# Altium project eBox_main.PrjPcb (part 1 of 2)
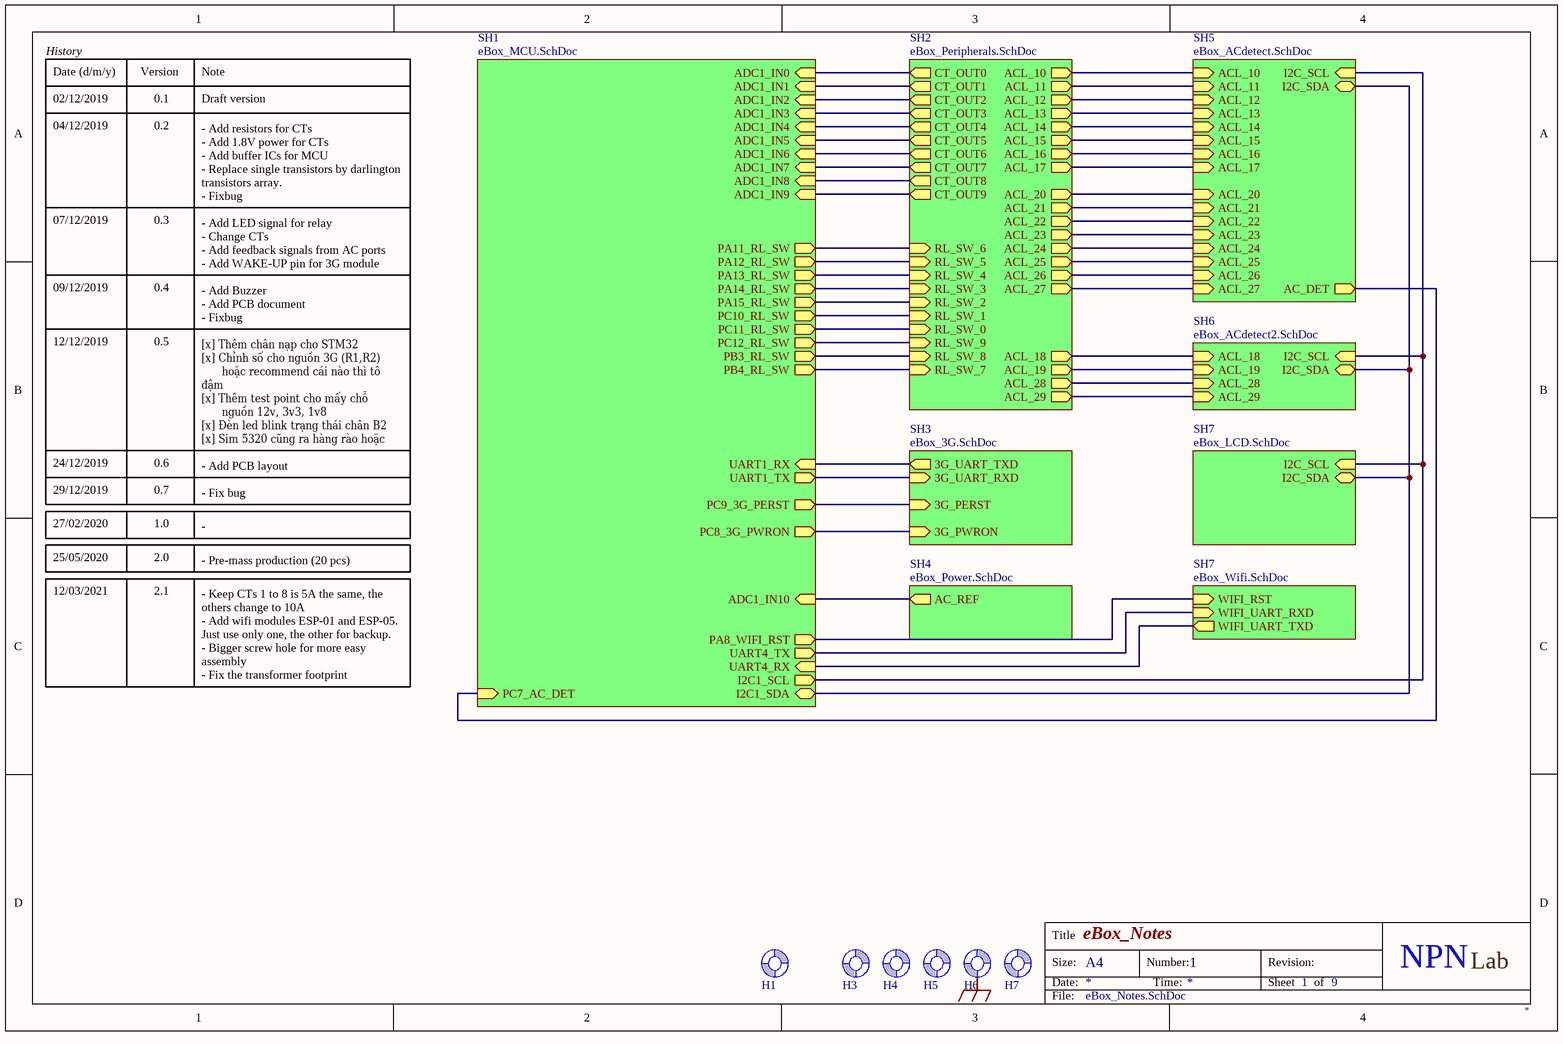
[diagram p0: eBox_Notes.SchDoc]
Hash: FK9KUBJZ; Version: 3.0
9 sheets, 424 parts. Net scope: hierarchical (ports join the sheet entries above them; power ports are global).
Board file: eBox_main.PcbDoc
Sheets:
  eBox_Notes.SchDoc
    SH1 = eBox_MCU.SchDoc
    SH2 = eBox_Peripherals.SchDoc
    SH3 = eBox_3G.SchDoc
    SH4 = eBox_Power.SchDoc
    SH5 = eBox_ACdetect.SchDoc
    SH6 = eBox_ACdetect2.SchDoc
    SH7 = eBox_LCD.SchDoc
    SH7 = eBox_Wifi.SchDoc

## Sheet eBox_Notes.SchDoc: eBox_Notes
size A4; DocumentNumber: 1; SheetNumber: 1; SheetTotal: 9

### Parts
H1  Screw Hole  [SCREW/3.2/7.0/M]  (value not drawn)  (no BOM)
H3  Screw Hole  [SCREW/3.2/7.0/M]  (value not drawn)  (no BOM)
H4  Screw Hole  [SCREW/3.2/7.0/M]  (value not drawn)  (no BOM)
H5  Screw Hole  [SCREW/3.2/7.0/M]  (value not drawn)  (no BOM)
H6  Screw Hole  [SCREW/3.2/7.0/M]  (value not drawn)  (no BOM)
H7  Screw Hole  [SCREW/3.2/7.0/M]  (value not drawn)  (no BOM)

### Sub-sheets
SH1 = eBox_MCU.SchDoc: PC8_3G_PWRON (out), PC9_3G_PERST (out), UART1_RX (in), UART1_TX (out), ADC1_IN0 (in), ADC1_IN1 (in), ADC1_IN2 (in), ADC1_IN3 (in), ADC1_IN4 (in), ADC1_IN5 (in), ADC1_IN6 (in), ADC1_IN9 (in), ADC1_IN7 (in), PA12_RL_SW (out), ADC1_IN8 (in), PA11_RL_SW (out), PA13_RL_SW (out), PA14_RL_SW (out), PA15_RL_SW (out), PC10_RL_SW (out), PC11_RL_SW (out), PB3_RL_SW (out), PB4_RL_SW (out), PC12_RL_SW (out), I2C1_SCL (out), I2C1_SDA (bidir), PC7_AC_DET (in), ADC1_IN10 (in), UART4_RX (in), UART4_TX (out), PA8_WIFI_RST (out)
SH2 = eBox_Peripherals.SchDoc: CT_OUT0 (out), CT_OUT1 (out), CT_OUT2 (out), CT_OUT3 (out), CT_OUT4 (out), CT_OUT5 (out), CT_OUT6 (out), CT_OUT7 (out), CT_OUT8 (out), CT_OUT9 (out), RL_SW_6 (in), RL_SW_5 (in), RL_SW_4 (in), RL_SW_3 (in), RL_SW_2 (in), RL_SW_1 (in), RL_SW_0 (in), RL_SW_9 (in), RL_SW_8 (in), RL_SW_7 (in), ACL_25 (out), ACL_24 (out), ACL_21 (out), ACL_20 (out), ACL_15 (out), ACL_14 (out), ACL_13 (out), ACL_10 (out), ACL_12 (out), ACL_11 (out), ACL_17 (out), ACL_16 (out), ACL_19 (out), ACL_18 (out), ACL_23 (out), ACL_28 (out), ACL_26 (out), ACL_22 (out), ACL_27 (out), ACL_29 (out)
SH3 = eBox_3G.SchDoc: 3G_UART_RXD (in), 3G_PERST (in), 3G_PWRON (in), 3G_UART_TXD (out)
SH4 = eBox_Power.SchDoc: AC_REF (out)
SH5 = eBox_ACdetect.SchDoc: I2C_SDA (bidir), I2C_SCL (in), ACL_16 (in), ACL_14 (in), ACL_15 (in), ACL_13 (in), ACL_11 (in), ACL_10 (in), ACL_12 (in), ACL_25 (in), ACL_24 (in), ACL_27 (in), ACL_26 (in), ACL_23 (in), ACL_22 (in), ACL_21 (in), ACL_20 (in), ACL_17 (in), AC_DET (out)
SH6 = eBox_ACdetect2.SchDoc: I2C_SDA (bidir), I2C_SCL (in), ACL_19 (in), ACL_29 (in), ACL_18 (in), ACL_28 (in)
SH7 = eBox_LCD.SchDoc: I2C_SCL (in), I2C_SDA (bidir)
SH7 = eBox_Wifi.SchDoc: WIFI_UART_TXD (out), WIFI_UART_RXD (in), WIFI_RST (in)

### Nets
GNDEARTH: H6.1(Screw)
ACL10: sheet SH2/ACL_10, sheet SH5/ACL_10
ACL11: sheet SH2/ACL_11, sheet SH5/ACL_11
ACL12: sheet SH2/ACL_12, sheet SH5/ACL_12
ACL13: sheet SH2/ACL_13, sheet SH5/ACL_13
ACL14: sheet SH2/ACL_14, sheet SH5/ACL_14
ACL15: sheet SH2/ACL_15, sheet SH5/ACL_15
ACL16: sheet SH2/ACL_16, sheet SH5/ACL_16
ACL17: sheet SH2/ACL_17, sheet SH5/ACL_17
ACL18: sheet SH2/ACL_18, sheet SH6/ACL_18
ACL19: sheet SH2/ACL_19, sheet SH6/ACL_19
ACL20: sheet SH2/ACL_20, sheet SH5/ACL_20
ACL21: sheet SH2/ACL_21, sheet SH5/ACL_21
ACL22: sheet SH2/ACL_22, sheet SH5/ACL_22
ACL23: sheet SH2/ACL_23, sheet SH5/ACL_23
ACL24: sheet SH2/ACL_24, sheet SH5/ACL_24
ACL25: sheet SH2/ACL_25, sheet SH5/ACL_25
ACL26: sheet SH2/ACL_26, sheet SH5/ACL_26
ACL27: sheet SH2/ACL_27, sheet SH5/ACL_27
ACL28: sheet SH2/ACL_28, sheet SH6/ACL_28
ACL29: sheet SH2/ACL_29, sheet SH6/ACL_29
I2C1_SCL: sheet SH1/I2C1_SCL, sheet SH5/I2C_SCL, sheet SH6/I2C_SCL, sheet SH7/I2C_SCL
I2C1_SDA: sheet SH1/I2C1_SDA, sheet SH5/I2C_SDA, sheet SH6/I2C_SDA, sheet SH7/I2C_SDA
PERST: sheet SH1/PC9_3G_PERST, sheet SH3/3G_PERST
PWRON: sheet SH1/PC8_3G_PWRON, sheet SH3/3G_PWRON
UART4_RX: sheet SH1/UART4_RX, sheet SH7/WIFI_UART_TXD
UART4_TX: sheet SH1/UART4_TX, sheet SH7/WIFI_UART_RXD
UART_RXD: sheet SH1/UART1_RX, sheet SH3/3G_UART_TXD
UART_TXD: sheet SH1/UART1_TX, sheet SH3/3G_UART_RXD
NetC538_2: sheet SH1/PC7_AC_DET, sheet SH5/AC_DET
NetM801_4: sheet SH1/PA8_WIFI_RST, sheet SH7/WIFI_RST
NetR103_1: sheet SH1/ADC1_IN10, sheet SH4/AC_REF
NetU201_14: sheet SH1/ADC1_IN0, sheet SH2/CT_OUT0
NetU201_15: sheet SH1/ADC1_IN1, sheet SH2/CT_OUT1
NetU201_16: sheet SH1/ADC1_IN2, sheet SH2/CT_OUT2
NetU201_17: sheet SH1/ADC1_IN3, sheet SH2/CT_OUT3
NetU201_20: sheet SH1/ADC1_IN4, sheet SH2/CT_OUT4
NetU201_21: sheet SH1/ADC1_IN5, sheet SH2/CT_OUT5
NetU201_22: sheet SH1/ADC1_IN6, sheet SH2/CT_OUT6
NetU201_23: sheet SH1/ADC1_IN7, sheet SH2/CT_OUT7
NetU201_26: sheet SH1/ADC1_IN8, sheet SH2/CT_OUT8
NetU201_27: sheet SH1/ADC1_IN9, sheet SH2/CT_OUT9
NetU202_12: sheet SH1/PC11_RL_SW, sheet SH2/RL_SW_0
NetU202_13: sheet SH1/PC10_RL_SW, sheet SH2/RL_SW_1
NetU202_14: sheet SH1/PA15_RL_SW, sheet SH2/RL_SW_2
NetU202_15: sheet SH1/PA14_RL_SW, sheet SH2/RL_SW_3
NetU202_16: sheet SH1/PA13_RL_SW, sheet SH2/RL_SW_4
NetU202_17: sheet SH1/PA12_RL_SW, sheet SH2/RL_SW_5
NetU202_18: sheet SH1/PA11_RL_SW, sheet SH2/RL_SW_6
NetU204_16: sheet SH1/PB4_RL_SW, sheet SH2/RL_SW_7
NetU204_17: sheet SH1/PB3_RL_SW, sheet SH2/RL_SW_8
NetU204_18: sheet SH1/PC12_RL_SW, sheet SH2/RL_SW_9

Not connected (* = marked no-connect by the designer): H1 1(Screw); H3 1(Screw); H4 1(Screw); H5 1(Screw); H7 1(Screw)

### Notes on the sheet
- History
- Date (d/m/y)
- 02/12/2019
- Version
- 0.1
- Note
- Draft version
- 04/12/2019
- 0.2
- 07/12/2019
- 0.3
- - Add resistors for CTs
  - Add 1.8V power for CTs
  - Add buffer ICs for MCU
  - Replace single transistors by darlington  transistors array.
  - Fixbug
- 09/12/2019
- 0.4
- - Add LED signal for relay
  - Change CTs
  - Add feedback signals from AC ports
  - Add WAKE-UP pin for 3G module
- 12/12/2019
- 0.5
- - Add Buzzer
  - Add PCB document
  - Fixbug
- [x] Thêm chân nạp cho STM32
  [x] Chỉnh số cho nguồn 3G (R1,R2)
  hoặc recommend cái nào thì tô đậm
  [x] Thêm test point cho mấy chỗ
  nguồn 12v, 3v3, 1v8
  [x] Đèn led blink trạng thái chân B2
  [x] Sim 5320 cũng ra hàng rào hoặc
  test point uart để test
- 24/12/2019
- 29/12/2019
- 0.6
- 0.7
- - Add PCB layout
- - Fix bug
- 27/02/2020
- 25/05/2020
- 1.0
- 2.0
- -
- - Pre-mass production (20 pcs)
- 12/03/2021
- 2.1
- - Keep CTs 1 to 8 is 5A the same, the others change to 10A
  - Add wifi modules ESP-01 and ESP-05. Just use only one, the other for backup.
  - Bigger screw hole for more easy assembly
  - Fix the transformer footprint
  - Use 5V power supply for the temperature sensor
- Title
- Size:
- Date:
- A4
- Number:
- Time:
- Revision:
- Sheet
- of
- NPN
- Lab
- File:

### Library data of the parts
H1 H3-H7 = Screw Hole: TYPE: NO-BOM; UNIT PRICE: 0

## Sheet eBox_MCU.SchDoc: eBox_MCU
size A4; DocumentNumber: 3; SheetNumber: 3; SheetTotal: 9
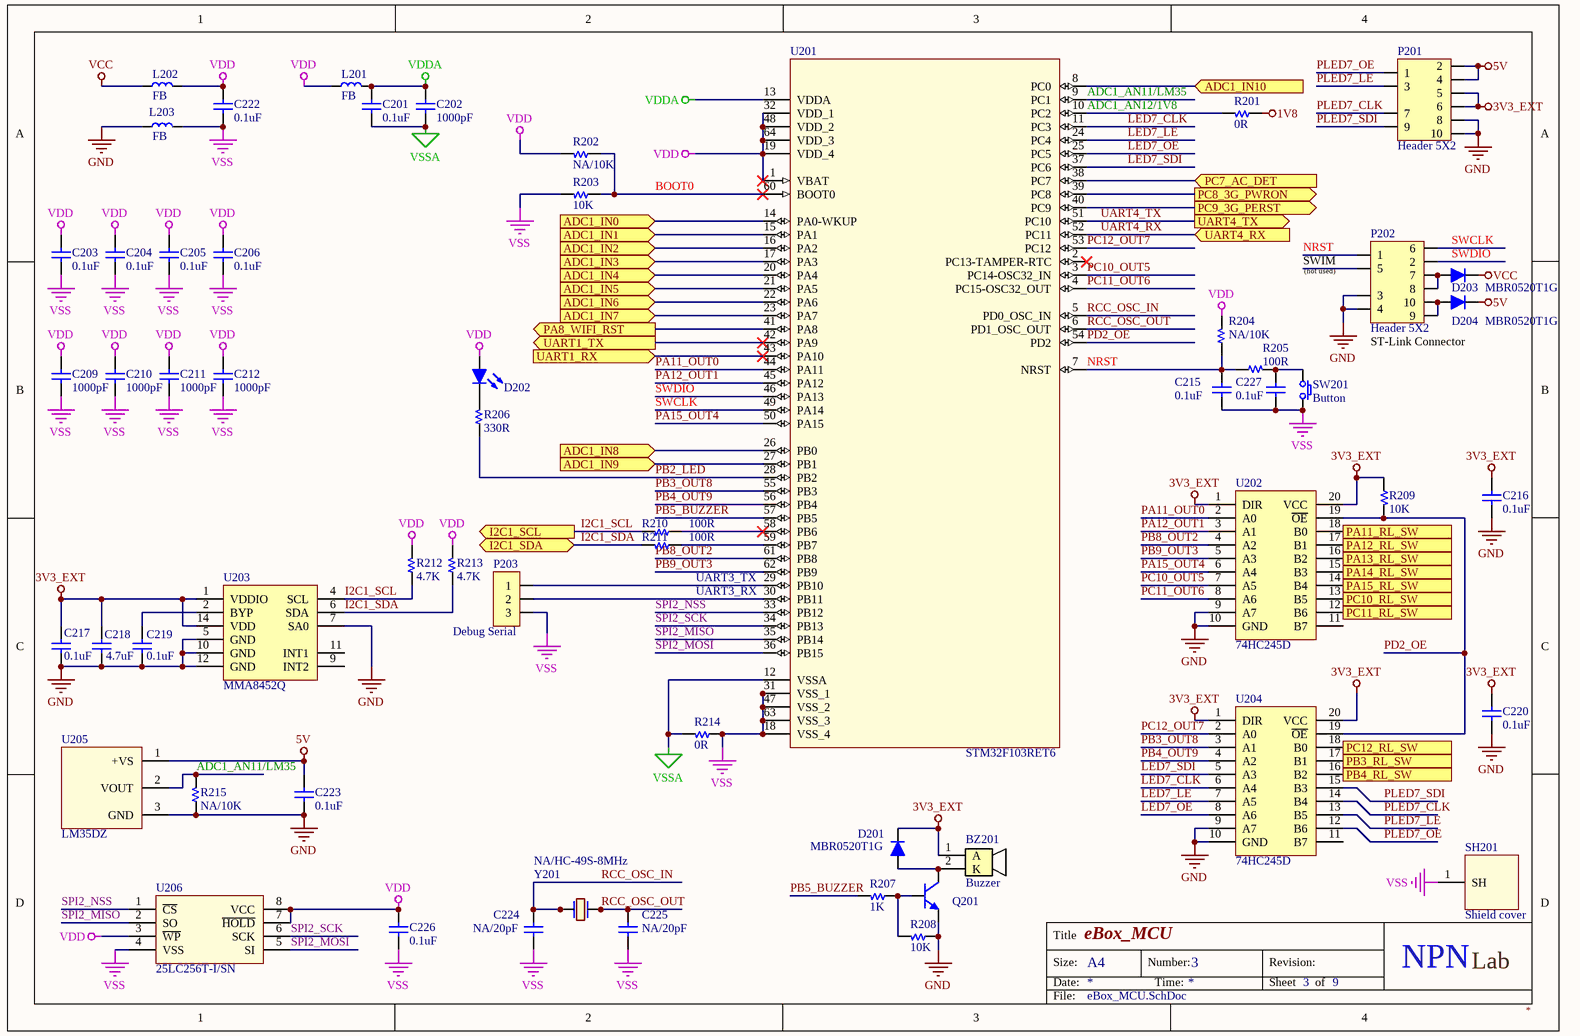
[diagram p1: eBox_MCU.SchDoc]

### Parts
BZ201  Buzzer  [BUZZER]
C201  0.1uF  [C 0603]
C202  1000pF  [C 0603]
C203  0.1uF  [C 0603]
C204  0.1uF  [C 0603]
C205  0.1uF  [C 0603]
C206  0.1uF  [C 0603]
C209  1000pF  [C 0603]
C210  1000pF  [C 0603]
C211  1000pF  [C 0603]
C212  1000pF  [C 0603]
C215  0.1uF  [C 0603]
C216  0.1uF  [C 0603]
C217  0.1uF  [C 0603]
C218  4.7uF  [C 0603]
C219  0.1uF  [C 0603]
C220  0.1uF  [C 0603]
C222  0.1uF  [C 0805]
C223  0.1uF  [C 0603]
C224  NA/20pF  [C 0603]
C225  NA/20pF  [C 0603]
C226  0.1uF  [C 0603]
C227  0.1uF  [C 0603]
D201  MBR0520T1G  [SOD123]
D202  5V Led  [LED 3MM - blue]  (value not drawn)
D203  MBR0520T1G  [SOD123]
D204  MBR0520T1G  [SOD123]
L201  FB  [L 0805 (2012)]
L202  FB  [L 0805 (2012)]
L203  FB  [L 0805 (2012)]
P201  Header 5X2  [HDR/Header/10/DL/BOX]
P202  Header 5X2  [HDR/Header/10/DL/BOX]
P203  Debug Serial  [HDR/Header/3]
Q201  MMBT3904LT1G  [SOT-23]  (value not drawn)
R201  0R  [R 0603]
R202  NA/10K  [R 0603]
R203  10K  [R 0603]
R204  NA/10K  [R 0603]
R205  100R  [R 0603]
R206  330R  [R 0603]
R207  1K  [R 0603]
R208  10K  [R 0603]
R209  10K  [R 0603]
R210  100R  [R 0603]
R211  100R  [R 0603]
R212  4.7K  [R 0603]
R213  4.7K  [R 0603]
R214  0R  [R 0603]
R215  NA/10K  [R 0603]
SH201  Shield cover  [SHIELD COVER 50x35]  (no BOM)
SW201  Button  [SW/2/DIP]
U201  STM32F103RET6  [STM-LQFP64]
U202  74HC245D  [SOIC-20]
U203  MMA8452Q  [MMA845xQ]
U204  74HC245D  [SOIC-20]
U205  LM35DZ  [TO-92/W100]
U206  25LC256T-I/SN  [SOIC-8-I/SN]
Y201  NA/HC-49S-8MHz  [Crystal HC49US SMD]
Y202  NA  [Crystal HC49S DIP]  (value not drawn)  (no BOM)

### Ports
ADC1_IN0 (in), ADC1_IN1 (in), ADC1_IN2 (in), ADC1_IN3 (in), ADC1_IN4 (in), ADC1_IN5 (in), ADC1_IN6 (in), ADC1_IN7 (in), ADC1_IN8 (in), ADC1_IN9 (in), ADC1_IN10 (in), I2C1_SCL (out), I2C1_SDA (bidir), PA8_WIFI_RST (out), PA11_RL_SW (out), PA12_RL_SW (out), PA13_RL_SW (out), PA14_RL_SW (out), PA15_RL_SW (out), PB3_RL_SW (out), PB4_RL_SW (out), PC7_AC_DET (in), PC8_3G_PWRON (out), PC9_3G_PERST (out), PC10_RL_SW (out), PC11_RL_SW (out), PC12_RL_SW (out), UART1_RX (in), UART1_TX (out), UART4_RX (in), UART4_TX (out)

### Nets
1V8: R201.1
3V3_EXT: BZ201.1(A) C216.1 C217.1 C218.1 C220.1 D201.2(K) P201.5 P201.6 R209.1 U202.1(DIR) U202.20(VCC) U203.1(VDDIO) U203.14(VDD) U204.1(DIR) U204.20(VCC)
5V: C223.1 D204.2(K) P201.2 P201.4 U205.1(+VS)
GND: C216.2 C217.2 C218.2 C219.2 C220.2 C223.2 L203.1 P201.8 P201.10 P202.3 P202.4 Q201.2(E) R208.1 R215.1 U202.9(A7) U202.10(GND) U203.5(GND) U203.7(SA0) U203.10(GND) U203.12(GND) U204.9(A7) U204.10(GND) U205.3(GND)
VCC: D203.2(K) L202.1
VDD: C203.1 C204.1 C205.1 C206.1 C209.1 C210.1 C211.1 C212.1 C222.1 C226.1 D202.1(A) L201.1 L202.2 R202.2 R204.2 R212.2 R213.2 U201.1(VBAT) U201.19(VDD_4) U201.32(VDD_1) U201.48(VDD_2) U201.64(VDD_3) U206.3(~{WP}) U206.7(~{HOLD}) U206.8(VCC)
VDDA: C201.1 C202.1 L201.2 U201.13(VDDA)
VSS: C203.2 C204.2 C205.2 C206.2 C209.2 C210.2 C211.2 C212.2 C215.2 C222.2 C224.2 C225.2 C226.2 C227.2 L203.2 P203.3 R203.2 R214.1 SH201.1(SH) SW201.2 U201.18(VSS_4) U201.31(VSS_1) U201.47(VSS_2) U201.63(VSS_3) U206.4(VSS)
VSSA: C201.2 C202.2 R214.2 U201.12(VSSA)
ADC1_AN11/LM35: R215.2 U201.9(PC1) U205.2(VOUT)
ADC1_AN12/1V8: R201.2 U201.10(PC2)
BOOT0: R202.1 R203.1 U201.60(BOOT0)
I2C1_SCL: R210.2 R212.1 U203.4(SCL) ; port I2C1_SCL
I2C1_SDA: R211.2 R213.1 U203.6(SDA) ; port I2C1_SDA
LED7_CLK: U201.11(PC3) U204.6(A4)
LED7_LE: U201.24(PC4) U204.7(A5)
LED7_OE: U201.25(PC5) U204.8(A6)
LED7_SDI: U201.37(PC6) U204.5(A3)
NRST: C215.1 P202.1 R204.1 R205.1 U201.7(NRST)
PA11_OUT0: U201.44(PA11) U202.2(A0)
PA12_OUT1: U201.45(PA12) U202.3(A1)
PA15_OUT4: U201.50(PA15) U202.6(A4)
PB2_LED: R206.1 U201.28(PB2)
PB3_OUT8: U201.55(PB3) U204.3(A1)
PB4_OUT9: U201.56(PB4) U204.4(A2)
PB5_BUZZER: R207.2 U201.57(PB5)
PB8_OUT2: U201.61(PB8) U202.4(A2)
PB9_OUT3: U201.62(PB9) U202.5(A3)
PC10_OUT5: U201.3(PC14-OSC32_IN) U202.7(A5)
PC11_OUT6: U201.4(PC15-OSC32_OUT) U202.8(A6)
PC12_OUT7: U201.53(PC12) U204.2(A0)
PD2_OE: R209.2 U201.54(PD2) U202.19(~{OE}) U204.19(~{OE})
PERST: U201.40(PC9) ; port PC9_3G_PERST
PLED7_CLK: P201.7 U204.14(B4)
PLED7_LE: P201.3 U204.13(B5)
PLED7_OE: P201.1 U204.12(B6)
PLED7_SDI: P201.9 U204.15(B3)
PWRON: U201.39(PC8) ; port PC8_3G_PWRON
RCC_OSC_IN: C224.1 U201.5(PD0_OSC_IN) Y201.1 Y202.1
RCC_OSC_OUT: C225.1 U201.6(PD1_OSC_OUT) Y201.2 Y202.2
SPI2_MISO: U201.35(PB14) U206.2(SO)
SPI2_MOSI: U201.36(PB15) U206.5(SI)
SPI2_NSS: U201.33(PB12) U206.1(~{CS})
SPI2_SCK: U201.34(PB13) U206.6(SCK)
SWCLK: P202.6 U201.49(PA14)
SWDIO: P202.2 U201.46(PA13)
UART3_RX: P203.2 U201.30(PB11)
UART3_TX: P203.1 U201.29(PB10)
UART4_RX: U201.52(PC11) ; port UART4_RX
UART4_TX: U201.51(PC10) ; port UART4_TX
UART_RXD: U201.43(PA10) ; port UART1_RX
UART_TXD: U201.42(PA9) ; port UART1_TX
NetBZ201_2: BZ201.2(K) D201.1(A) Q201.3(C)
NetC219_1: C219.1 U203.2(BYP)
NetC227_1: C227.1 R205.2 SW201.1
NetC538_2: U201.38(PC7) ; port PC7_AC_DET
NetD202_2: D202.2(K) R206.2
NetD203_1: D203.1(A) P202.7 P202.8
NetD204_1: D204.1(A) P202.9 P202.10
NetM801_4: U201.41(PA8) ; port PA8_WIFI_RST
NetQ201_1: Q201.1(B) R207.1 R208.2
NetR103_1: U201.8(PC0) ; port ADC1_IN10
NetR210_1: R210.1 U201.58(PB6)
NetR211_1: R211.1 U201.59(PB7)
NetU201_14: U201.14(PA0-WKUP) ; port ADC1_IN0
NetU201_15: U201.15(PA1) ; port ADC1_IN1
NetU201_16: U201.16(PA2) ; port ADC1_IN2
NetU201_17: U201.17(PA3) ; port ADC1_IN3
NetU201_20: U201.20(PA4) ; port ADC1_IN4
NetU201_21: U201.21(PA5) ; port ADC1_IN5
NetU201_22: U201.22(PA6) ; port ADC1_IN6
NetU201_23: U201.23(PA7) ; port ADC1_IN7
NetU201_26: U201.26(PB0) ; port ADC1_IN8
NetU201_27: U201.27(PB1) ; port ADC1_IN9
NetU202_12: U202.12(B6) ; port PC11_RL_SW
NetU202_13: U202.13(B5) ; port PC10_RL_SW
NetU202_14: U202.14(B4) ; port PA15_RL_SW
NetU202_15: U202.15(B3) ; port PA14_RL_SW
NetU202_16: U202.16(B2) ; port PA13_RL_SW
NetU202_17: U202.17(B1) ; port PA12_RL_SW
NetU202_18: U202.18(B0) ; port PA11_RL_SW
NetU204_16: U204.16(B2) ; port PB4_RL_SW
NetU204_17: U204.17(B1) ; port PB3_RL_SW
NetU204_18: U204.18(B0) ; port PC12_RL_SW

Not connected (* = marked no-connect by the designer): P202 5; U201 2(PC13-TAMPER-RTC)*; U202 11(B7); U203 9(INT2) 11(INT1); U204 11(B7)

### Notes on the sheet
- (near P202) SWIM
- (near P202) (not used)
- ST-Link Connector
- Title
- Size:
- Date:
- A4
- Number:
- Time:
- Revision:
- Sheet
- of
- NPN
- Lab
- File:

### Library data of the parts
C201-C206 C209-C212 C215-C217 C219 C220 C223 C226 C227 = Capacitor NP: CAP CER 0.1UF 50V X7R 0603; TYPE: SMD; PACKAGE: SMD0603; STOCK CODE: CC0603KRX7R9BB104; SUPPLIER: tme.vn; STOCK DESC: 100nF/50V ±10% X7R SMD-0603 Capacitor; UNIT PRICE: 400
C218 = Capacitor NP: CAP CER 4.7UF 50V X7R 0603; TYPE: SMD; PACKAGE: SMD0603; STOCK CODE: CC0603KRX5R6BB475; SUPPLIER: tme.vn; STOCK DESC: 4.7uF 10V ±10% X5R SMD-0603 Capacitor; UNIT PRICE: 600
C222 = Capacitor NP: CAP CER 0.1UF 50V X7R 0805; TYPE: SMD; PACKAGE: SMD0805; STOCK CODE: CL21B104KBNC; SUPPLIER: tme.vn; STOCK DESC: 100nF/50V ±10% X7R SMD-0805 Capacitor; UNIT PRICE: 400
C224 C225 = Capacitor NP: CAP CER 20pF 50V X7R 0603; TYPE: SMD; PACKAGE: SMD0603; STOCK CODE: CC0603JRNPO9BN100; SUPPLIER: tme.vn; STOCK DESC: 10pF/50V ±5% NPO SMD-0603 Capacitor; UNIT PRICE: 400
D201 D203 D204 = Diode: DIODE SCHOTTKY 20V 500MA SOD123; TYPE: SMD; PACKAGE: SOD123; PART NO: MBR0520T1G; STOCK CODE: MBR0520T1G; SUPPLIER: tme.vn; STOCK DESC: 0.5A 20V SMD Schottky Rectifier Diode; UNIT PRICE: 2000
D202 = Led: LED BLUE DIFFUSED 3MM ROUND T/H; TYPE: TH; PACKAGE: 3MM; STOCK CODE: HT204SURD; SUPPLIER: tme.vn; STOCK DESC: 3mm Base LED; UNIT PRICE: 300
L201-L203 = Inductor: Chip Ferrite Bead; TYPE: SMD; PACKAGE: SMD0805; STOCK CODE: CB2012D300ST(F); SUPPLIER: tme.vn; STOCK DESC: 30 Ohm SMD-0805 Chip Ferrite Bead; UNIT PRICE: 500
P201 P202 = Header 5X2: Header, 5-Pin, Dual row; TYPE: TH; UNIT PRICE: 0
P203 = Header 3: Header, 3-Pin; TYPE: TH; UNIT PRICE: 0
Q201 = Transistor NPN: TRANS NPN 40V 0.2A SOT23; TYPE: SMD; STOCK CODE: LMBT3904LT1G; SUPPLIER: tme.vn; STOCK DESC: NPN General-Purpose Amplifier SMD Transistor; UNIT PRICE: 600
R201-R204 R208 R209 R215 = Resistor: RES SMD 10K OHM 1% 1/10W 0603; PACKAGE: SMD0603; TYPE: SMD
  R201: UNIT PRICE: 0
  R202-R204 R208 R209 R215: STOCK CODE: 0603F1000T5E; SUPPLIER: tme.vn; STOCK DESC: 10K ±1% SMD-0603 Resistor; UNIT PRICE: 60
R205 R210 R211 = Resistor: RES SMD 100 OHM 1% 1/10W 0603; PACKAGE: SMD0603; STOCK CODE: RM06FTN1000; SUPPLIER: tme.vn; TYPE: SMD; STOCK DESC: 100R ±1% SMD-0603 Resistor; UNIT PRICE: 50
R206 = Resistor: RES SMD 330 OHM 1% 1/10W 0603; PACKAGE: SMD0603; STOCK CODE: RM06JTN331; SUPPLIER: tme.vn; TYPE: SMD; STOCK DESC: 330R ±5% SMD-0603 Resistor; UNIT PRICE: 50
R207 = Resistor: RES SMD 1K OHM 1% 1/10W 0603; PACKAGE: SMD0603; STOCK CODE: RM06JTN103; SUPPLIER: tme.vn; TYPE: SMD; STOCK DESC: 10K ±5% SMD-0603 Resistor; UNIT PRICE: 50
R212 R213 = Resistor: RES SMD 4.7K OHM 1% 1/10W 0603; PACKAGE: SMD0603; STOCK CODE: RM06JTN472; SUPPLIER: tme.vn; TYPE: SMD; STOCK DESC: 4.7K ±5% SMD-0603 Resistor; UNIT PRICE: 50
R214 = Resistor: RES SMD 0 OHM 5% 1/10W 0603; PACKAGE: SMD0603; STOCK CODE: RM06JTN0; SUPPLIER: tme.vn; TYPE: SMD; STOCK DESC: 0R ±5% SMD-0603 Resistor; UNIT PRICE: 50
SW201 = SW SPST: Tact switch 2 pin; STOCK CODE: KAN0611-0501B; SUPPLIER: tme.vn; TYPE: TH; STOCK DESC: Tact Switch 6x6x5 mm Black; UNIT PRICE: 1000
U201 = STM32F103RBT6: ARM® Cortex®-M3 series Microcontroller IC 32-Bit 72MHz 512KB (512K x 8) FLASH; Package: LQFP-64; PART NO: STM32F103RET6; STOCK CODE: STM32F103RET6; SUPPLIER: tme.vn; TYPE: SMD; STOCK DESC: MCU ARM 512KB FLASH LQFP-64; UNIT PRICE: 70000
U202 U204 = 74HC245D: IC TRANSCVR NON-INVERT 6V 20SO; BRAND: NXP; PACKAGE: SOIC-20; STOCK CODE: 74HC245D; SUPPLIER: tme.vn; TYPE: SMD; STOCK DESC: Octal bus transceiver; 3-state, Non-Inverting; UNIT PRICE: 5000
U203 = MMA845xQ: Freescale's 3-axis digital accelerometer; BRAND: Freescale; PACKAGE: QFN-16; PART NO: MMA8452Q; STOCK CODE: MMA8452Q; SUPPLIER: tme.vn; TYPE: SMD; STOCK DESC: 3-Axis, 12-bit/8-bit Digital Accelerometer; UNIT PRICE: 60000
U205 = LM35DZ: SENSOR ANALOG 0C-100C TO92-3; PACKAGE: TO-92; STOCK CODE: LM35DZ; SUPPLIER: tme.vn; TYPE: TH; STOCK DESC: Analog Thermometer; UNIT PRICE: 30000
U206 = 25LC256T-I/SN: IC EEPROM 256K SPI 10MHZ 8SOIC; PART NO: 25LC256-I/SN; BRAND: Microchip; PACKAGE: SOIC-8; STOCK CODE: 25LC256-I/SN; SUPPLIER: tme.vn; TYPE: SMD; STOCK DESC: 256 Kbit SPI Bus Serial EEPROM, 10MHZ 8SOIC; UNIT PRICE: 25000
Y201 = Crystal: 8 MHz HC-49S SMD Crystal; PACKAGE: HC49/US; STOCK CODE: 8M-HC49S SMD; SUPPLIER: tme.vn; TYPE: SMD; STOCK DESC: 8 MHz HC-49S SMD Crystal; UNIT PRICE: 4000
Y202 = Crystal: TYPE: NO-BOM
BZ201 = Buzzer: STOCK CODE: YMD-12065G-5V; SUPPLIER: tme.vn; TYPE: TH; STOCK DESC: 5V Magneticc Buzzer, 85dB, 6.5x12 mm; UNIT PRICE: 5000
SH201 = Shield cover: TYPE: NO-BOM

## Sheet eBox_Peripherals.SchDoc: eBox_Peripherals
size A4; DocumentNumber: 4; SheetNumber: 4; SheetTotal: 9
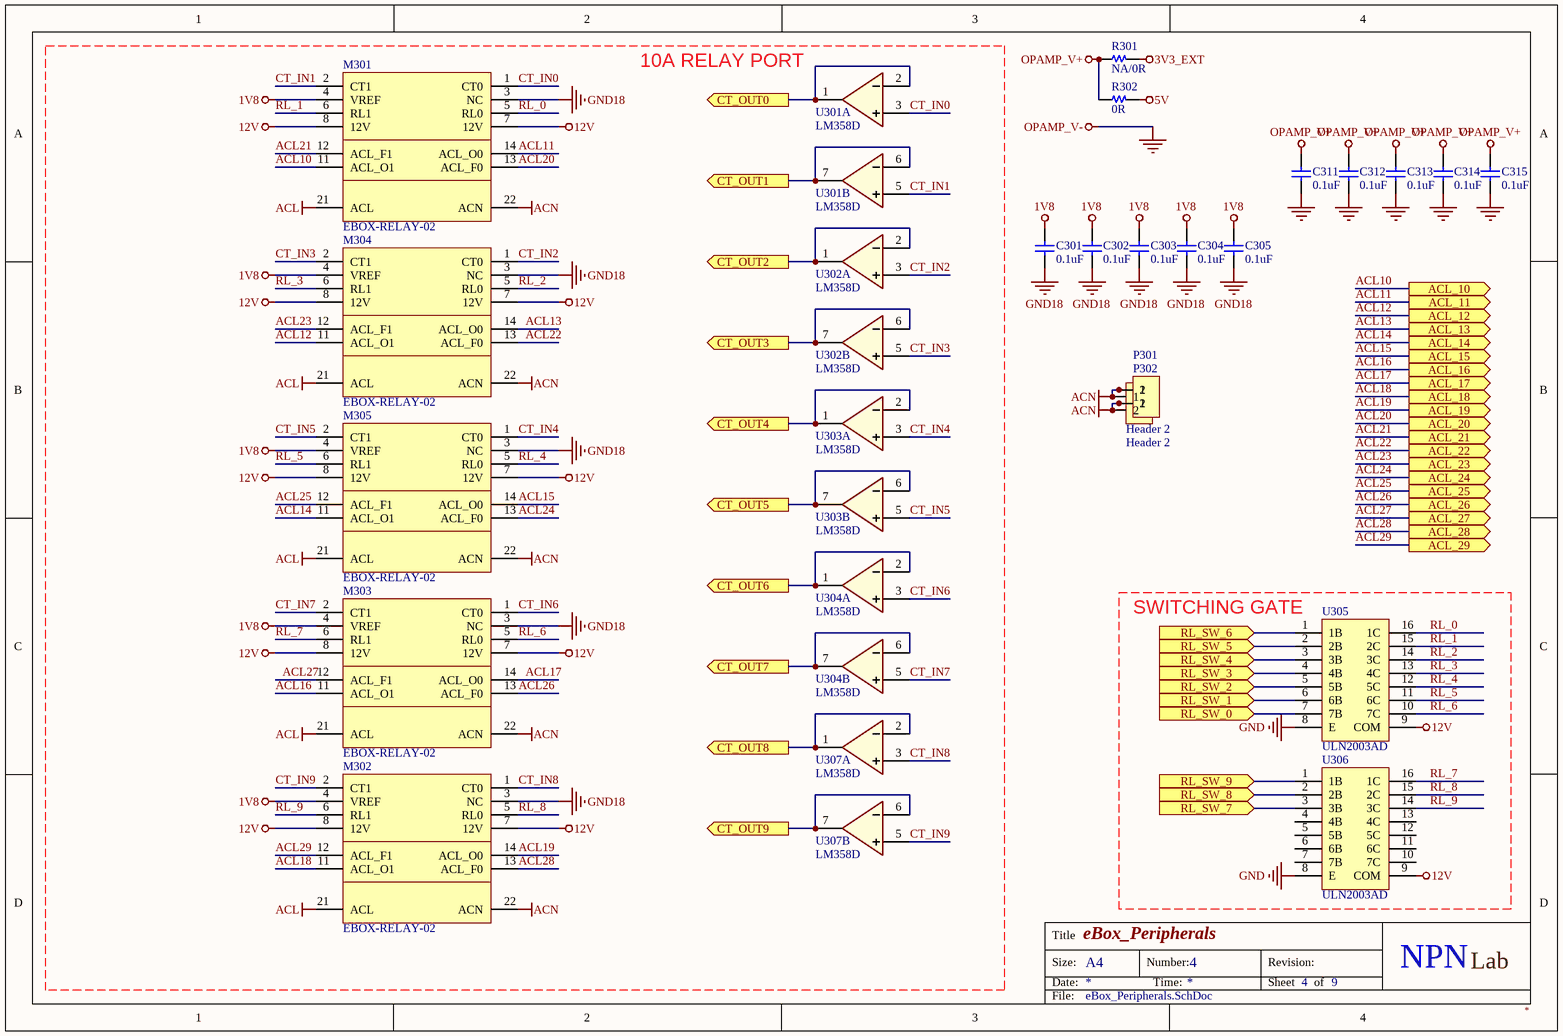
[diagram p2: eBox_Peripherals.SchDoc]

### Parts
C301  0.1uF  [C 0805]
C302  0.1uF  [C 0805]
C303  0.1uF  [C 0805]
C304  0.1uF  [C 0805]
C305  0.1uF  [C 0805]
C311  0.1uF  [C 0805]
C312  0.1uF  [C 0805]
C313  0.1uF  [C 0805]
C314  0.1uF  [C 0805]
C315  0.1uF  [C 0805]
M301  EBOX-RELAY-02  [EBOX-RELAY-02-90]
M302  EBOX-RELAY-02  [EBOX-RELAY-02-90]
M303  EBOX-RELAY-02  [EBOX-RELAY-02-90]
M304  EBOX-RELAY-02  [EBOX-RELAY-02-90]
M305  EBOX-RELAY-02  [EBOX-RELAY-02-90]
P301  Header 2  [HDR/Terminal/2/KF1000]  (no BOM)
P302  Header 2  [HDR/Terminal/2/KF55C-10]
P303  Header 2  [HDR/Terminal/2/KF1000]  (value not drawn)  (no BOM)
R301  NA/0R  [R 0603]
R302  0R  [R 0603]
U301  LM358D  [SOIC-8]  (parts A,B of 2)
U302  LM358D  [SOIC-8]  (parts A,B of 2)
U303  LM358D  [SOIC-8]  (parts A,B of 2)
U304  LM358D  [SOIC-8]  (parts A,B of 2)
U305  ULN2003AD  [SOIC-16]
U306  ULN2003AD  [SOIC-16]
U307  LM358D  [SOIC-8]  (parts A,B of 2)

### Ports
ACL_10 (out), ACL_11 (out), ACL_12 (out), ACL_13 (out), ACL_14 (out), ACL_15 (out), ACL_16 (out), ACL_17 (out), ACL_18 (out), ACL_19 (out), ACL_20 (out), ACL_21 (out), ACL_22 (out), ACL_23 (out), ACL_24 (out), ACL_25 (out), ACL_26 (out), ACL_27 (out), ACL_28 (out), ACL_29 (out), CT_OUT0 (out), CT_OUT1 (out), CT_OUT2 (out), CT_OUT3 (out), CT_OUT4 (out), CT_OUT5 (out), CT_OUT6 (out), CT_OUT7 (out), CT_OUT8 (out), CT_OUT9 (out), RL_SW_0 (in), RL_SW_1 (in), RL_SW_2 (in), RL_SW_3 (in), RL_SW_4 (in), RL_SW_5 (in), RL_SW_6 (in), RL_SW_7 (in), RL_SW_8 (in), RL_SW_9 (in)

### Nets
1V8: C301.1 C302.1 C303.1 C304.1 C305.1 M301.4(VREF) M302.4(VREF) M303.4(VREF) M304.4(VREF) M305.4(VREF)
3V3_EXT: R301.2
5V: R302.2
12V: M301.7(12V) M301.8(12V) M302.7(12V) M302.8(12V) M303.7(12V) M303.8(12V) M304.7(12V) M304.8(12V) M305.7(12V) M305.8(12V) U305.9(COM) U306.9(COM)
ACL: M301.21(ACL) M302.21(ACL) M303.21(ACL) M304.21(ACL) M305.21(ACL)
ACN: M301.22(ACN) M302.22(ACN) M303.22(ACN) M304.22(ACN) M305.22(ACN) P301.1 P301.2 P302.1 P302.2 P303.1 P303.2
GND: C311.2 C312.2 C313.2 C314.2 C315.2 U301.4(GND) U302.4(GND) U303.4(GND) U304.4(GND) U305.8(E) U306.8(E) U307.4(GND)  [also labelled OPAMP_V-]
GND18: C301.2 C302.2 C303.2 C304.2 C305.2 M301.3(NC) M302.3(NC) M303.3(NC) M304.3(NC) M305.3(NC)
OPAMP_V+: C311.1 C312.1 C313.1 C314.1 C315.1 R301.1 R302.1 U301.8(VCC) U302.8(VCC) U303.8(VCC) U304.8(VCC) U307.8(VCC)
ACL10: M301.11(ACL_O1) ; port ACL_10
ACL11: M301.14(ACL_O0) ; port ACL_11
ACL12: M304.11(ACL_O1) ; port ACL_12
ACL13: M304.14(ACL_O0) ; port ACL_13
ACL14: M305.11(ACL_O1) ; port ACL_14
ACL15: M305.14(ACL_O0) ; port ACL_15
ACL16: M303.11(ACL_O1) ; port ACL_16
ACL17: M303.14(ACL_O0) ; port ACL_17
ACL18: M302.11(ACL_O1) ; port ACL_18
ACL19: M302.14(ACL_O0) ; port ACL_19
ACL20: M301.13(ACL_F0) ; port ACL_20
ACL21: M301.12(ACL_F1) ; port ACL_21
ACL22: M304.13(ACL_F0) ; port ACL_22
ACL23: M304.12(ACL_F1) ; port ACL_23
ACL24: M305.13(ACL_F0) ; port ACL_24
ACL25: M305.12(ACL_F1) ; port ACL_25
ACL26: M303.13(ACL_F0) ; port ACL_26
ACL27: M303.12(ACL_F1) ; port ACL_27
ACL28: M302.13(ACL_F0) ; port ACL_28
ACL29: M302.12(ACL_F1) ; port ACL_29
CT_IN0: M301.1(CT0) U301.3(A+)
CT_IN1: M301.2(CT1) U301.5(B+)
CT_IN2: M304.1(CT0) U302.3(A+)
CT_IN3: M304.2(CT1) U302.5(B+)
CT_IN4: M305.1(CT0) U303.3(A+)
CT_IN5: M305.2(CT1) U303.5(B+)
CT_IN6: M303.1(CT0) U304.3(A+)
CT_IN7: M303.2(CT1) U304.5(B+)
CT_IN8: M302.1(CT0) U307.3(A+)
CT_IN9: M302.2(CT1) U307.5(B+)
RL_0: M301.5(RL0) U305.16(1C)
RL_1: M301.6(RL1) U305.15(2C)
RL_2: M304.5(RL0) U305.14(3C)
RL_3: M304.6(RL1) U305.13(4C)
RL_4: M305.5(RL0) U305.12(5C)
RL_5: M305.6(RL1) U305.11(6C)
RL_6: M303.5(RL0) U305.10(7C)
RL_7: M303.6(RL1) U306.16(1C)
RL_8: M302.5(RL0) U306.15(2C)
RL_9: M302.6(RL1) U306.14(3C)
NetU201_14: U301.1(OutA) U301.2(A-) ; port CT_OUT0
NetU201_15: U301.6(B-) U301.7(OutB) ; port CT_OUT1
NetU201_16: U302.1(OutA) U302.2(A-) ; port CT_OUT2
NetU201_17: U302.6(B-) U302.7(OutB) ; port CT_OUT3
NetU201_20: U303.1(OutA) U303.2(A-) ; port CT_OUT4
NetU201_21: U303.6(B-) U303.7(OutB) ; port CT_OUT5
NetU201_22: U304.1(OutA) U304.2(A-) ; port CT_OUT6
NetU201_23: U304.6(B-) U304.7(OutB) ; port CT_OUT7
NetU201_26: U307.1(OutA) U307.2(A-) ; port CT_OUT8
NetU201_27: U307.6(B-) U307.7(OutB) ; port CT_OUT9
NetU202_12: U305.7(7B) ; port RL_SW_0
NetU202_13: U305.6(6B) ; port RL_SW_1
NetU202_14: U305.5(5B) ; port RL_SW_2
NetU202_15: U305.4(4B) ; port RL_SW_3
NetU202_16: U305.3(3B) ; port RL_SW_4
NetU202_17: U305.2(2B) ; port RL_SW_5
NetU202_18: U305.1(1B) ; port RL_SW_6
NetU204_16: U306.3(3B) ; port RL_SW_7
NetU204_17: U306.2(2B) ; port RL_SW_8
NetU204_18: U306.1(1B) ; port RL_SW_9

Not connected (* = marked no-connect by the designer): U306 4(4B) 5(5B) 6(6B) 7(7B) 10(7C) 11(6C) 12(5C) 13(4C)

### Notes on the sheet
- 10A RELAY PORT
- SWITCHING GATE
- Title
- Size:
- Date:
- A4
- Number:
- Time:
- Revision:
- Sheet
- of
- NPN
- Lab
- File:

### Library data of the parts
C301-C305 C311-C315 = Capacitor NP: CAP CER 0.1UF 50V X7R 0805; TYPE: SMD; PACKAGE: SMD0805; STOCK CODE: CL21B104KBNC; SUPPLIER: tme.vn; STOCK DESC: 100nF/50V ±10% X7R SMD-0805 Capacitor; UNIT PRICE: 400
P301-P303 = Header 2: Header, 2-Pin
  P301 P303: TYPE: NO-BOM
  P302: TYPE: TH
R301 = Resistor: RES SMD 0 OHM 1% 1/10W 0603; PACKAGE: SMD0603; TYPE: SMD
R302 = Resistor: RES SMD 0 OHM 5% 1/10W 0603; PACKAGE: SMD0603; STOCK CODE: RM06JTN0; SUPPLIER: tme.vn; TYPE: SMD; STOCK DESC: 0R ±5% SMD-0603 Resistor; UNIT PRICE: 50
U301-U304 U307 = LM358: Low Power Dual Operational Amplifiers; PART NO: LM358DR; BRAND: TI; PACKAGE: SOIC-8; STOCK CODE: 296-1014-1-ND; SUPPLIER: Digi-Key; TYPE: SMD; STOCK DESC: IC OPAMP GP 2 CIRCUIT 8SOIC; UNIT PRICE: 8375
U305 U306 = ULN2003: IC PWR RELAY 7NPN 1:1 16SOIC; BRAND: Texas Instruments; PACKAGE: SOIC-16; PART NO: ULN2003AD; STOCK CODE: ULN2003AD; SUPPLIER: tme.vn; TYPE: SMD; STOCK DESC: TRANS 7 NPN DARL 50V 500MA 16SO; UNIT PRICE: 5000
M301-M305 = EBOX-RELAY-02: PART NO: EBOX-RELAY-02; STOCK CODE: EBOX-RELAY-02; TYPE: TH

## Sheet eBox_3G.SchDoc: eBox_3G
size A4; DocumentNumber: 5; SheetNumber: 5; SheetTotal: 9
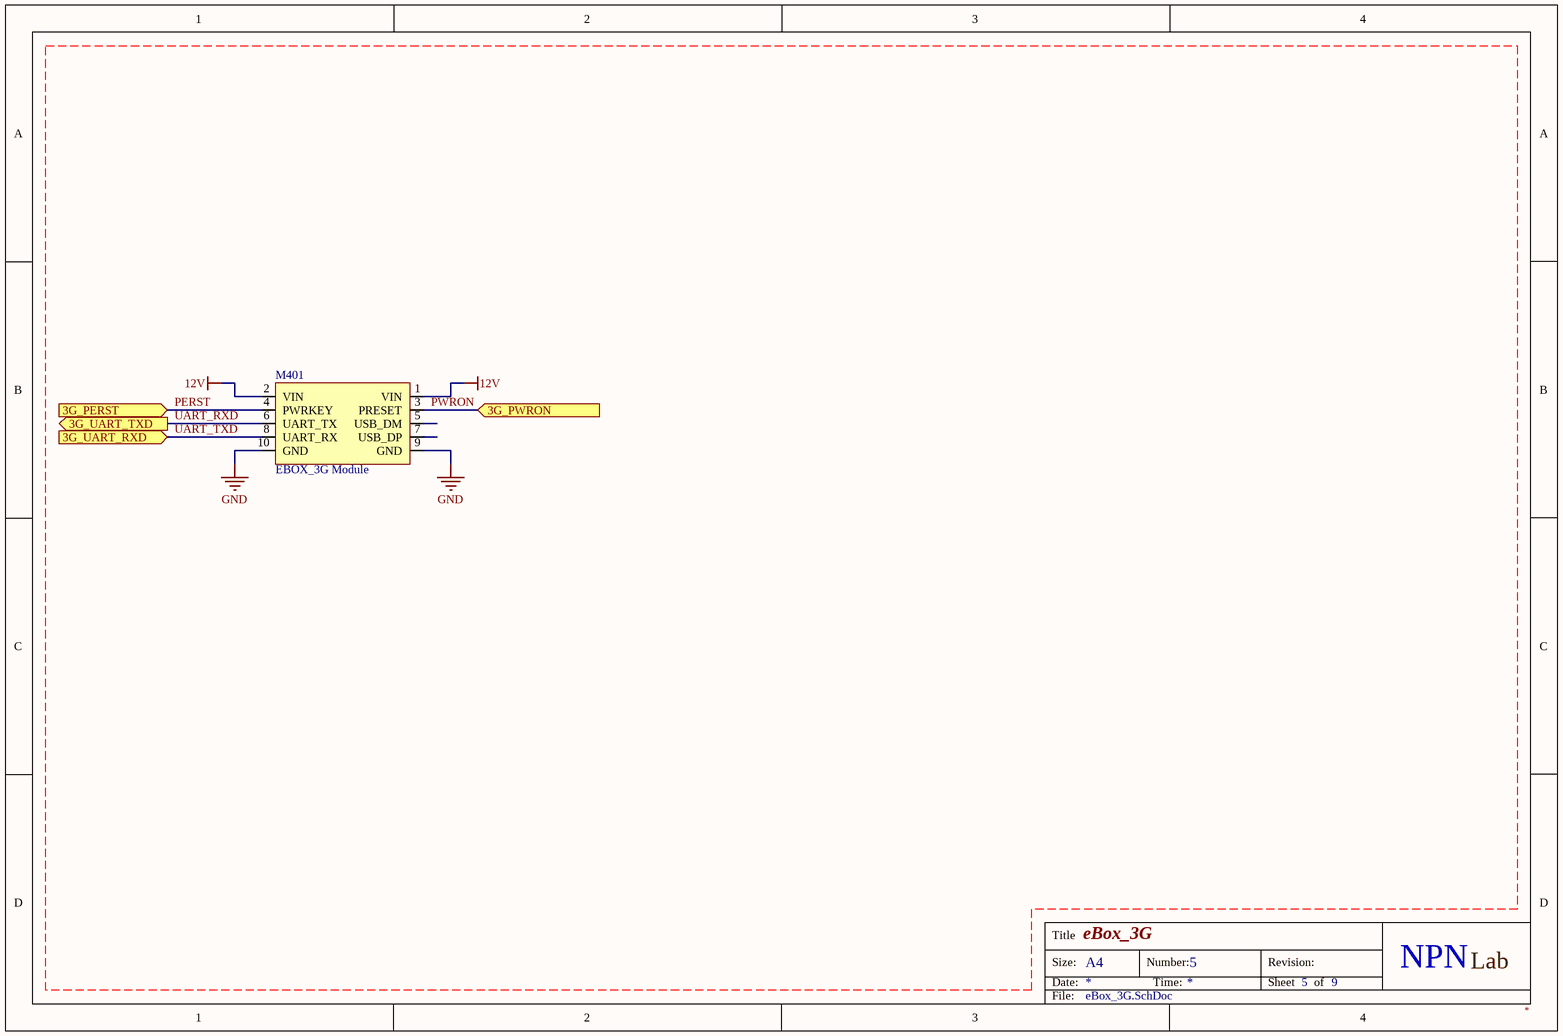
[diagram p3: eBox_3G.SchDoc]

### Parts
M401  EBOX_3G Module  [EBOX_3G]

### Ports
3G_PERST (in), 3G_PWRON (in), 3G_UART_RXD (in), 3G_UART_TXD (out)

### Nets
12V: M401.1(VIN) M401.2(VIN)
GND: M401.9(GND) M401.10(GND)
PERST: M401.4(PWRKEY) ; port 3G_PERST
PWRON: M401.3(PRESET) ; port 3G_PWRON
UART_RXD: M401.6(UART_TX) ; port 3G_UART_TXD
UART_TXD: M401.8(UART_RX) ; port 3G_UART_RXD

Not connected (* = marked no-connect by the designer): M401 5(USB_DM) 7(USB_DP)

### Notes on the sheet
- Title
- Size:
- Date:
- A4
- Number:
- Time:
- Revision:
- Sheet
- of
- NPN
- Lab
- File:

### Library data of the parts
M401 = EBOX_3G Module: TYPE: TH

## Sheet eBox_Power.SchDoc: eBox_Power
size A4; DocumentNumber: 2; SheetNumber: 2; SheetTotal: 9
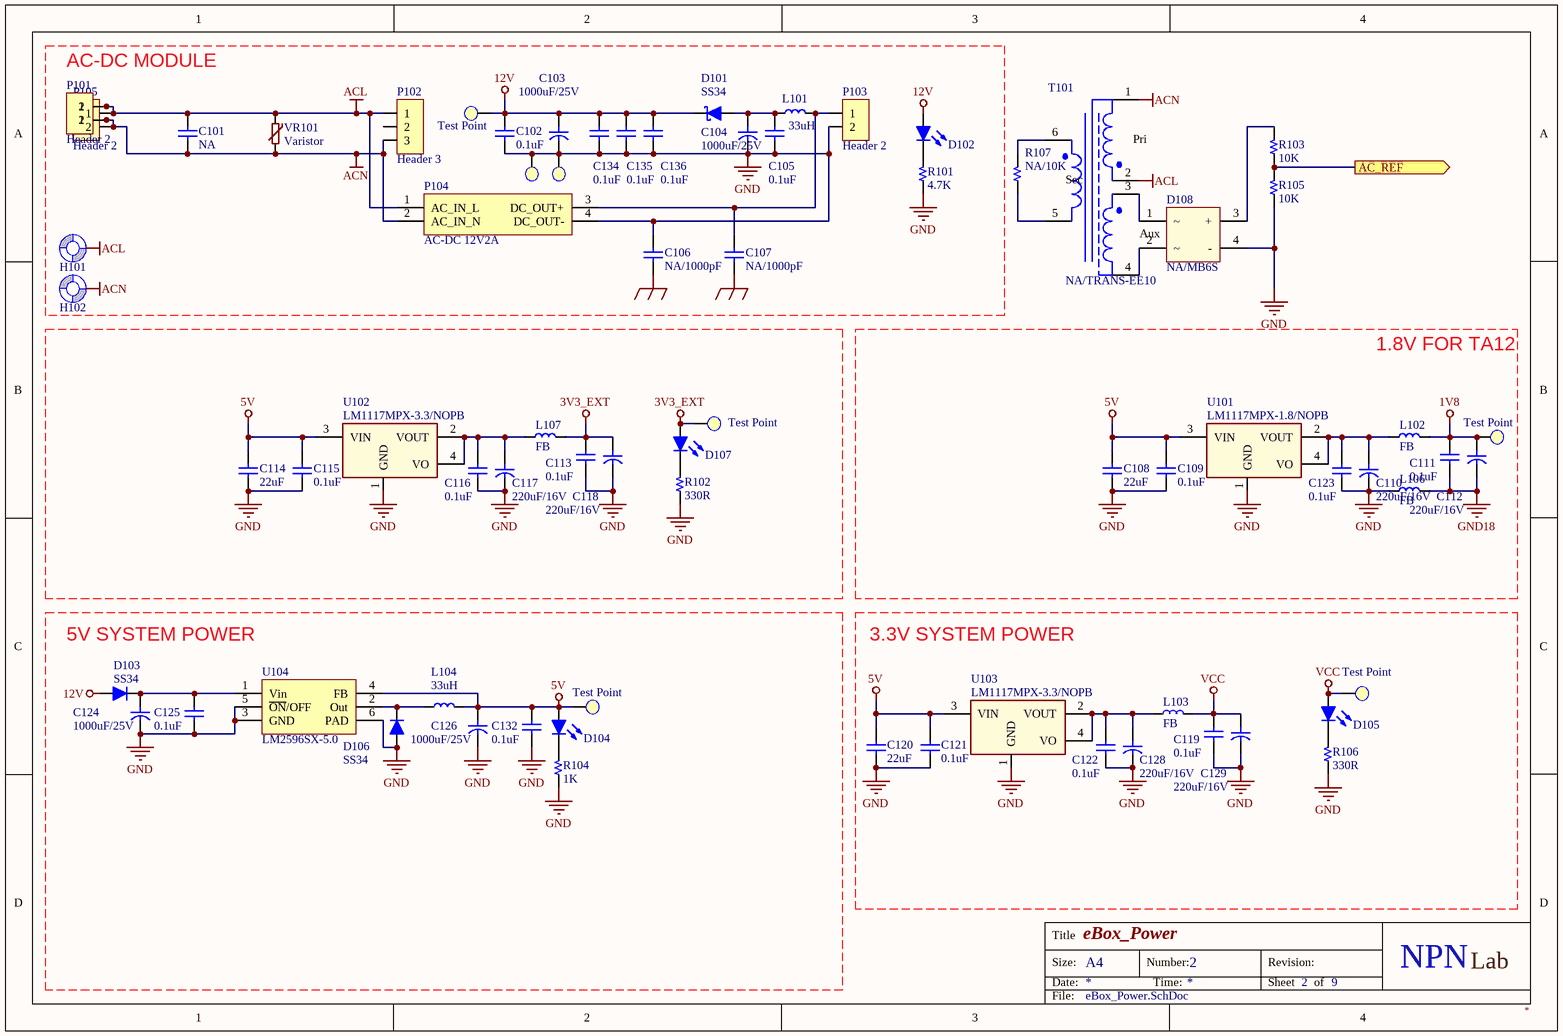
[diagram p4: eBox_Power.SchDoc]

### Parts
1V8  Test Point  [TestPoint/SMD/1.5mm]  (no BOM)
3V3EXT  Test Point  [TestPoint/SMD/1.5mm]  (no BOM)
5V  Test Point  [TestPoint/SMD/1.5mm]  (no BOM)
12V  Test Point  [TestPoint/SMD/1.5mm]  (no BOM)
C101  NA  [CAP Ceramic/D7.0/F7.5]
C102  0.1uF  [C 0805]
C103  1000uF/25V  [CAP/D100/H200/LS50]
C104  1000uF/25V  [CAP/D100/H200/LS50]
C105  0.1uF  [C 0805]
C106  NA/1000pF  [CAP Ceramic/W300]
C107  NA/1000pF  [CAP Ceramic/W300]
C108  22uF  [C 1210 mix 0805]
C109  0.1uF  [C 0805]
C110  220uF/16V  [CYL/D.250/LS.100-D63H70P25]
C111  0.1uF  [C 0805]
C112  220uF/16V  [CYL/D.250/LS.100-D63H70P25]
C113  0.1uF  [C 0805]
C114  22uF  [C 1210 mix 0805]
C115  0.1uF  [C 0805]
C116  0.1uF  [C 0805]
C117  220uF/16V  [CYL/D.250/LS.100-D63H70P25]
C118  220uF/16V  [CYL/D.250/LS.100-D63H70P25]
C119  0.1uF  [C 0805]
C120  22uF  [C 1210 mix 0805]
C121  0.1uF  [C 0805]
C122  0.1uF  [C 0805]
C123  0.1uF  [C 0805]
C124  1000uF/25V  [CAP/D100/H200/LS50]
C125  0.1uF  [C 0805]
C126  1000uF/25V  [CAP/D100/H200/LS50]
C128  220uF/16V  [CYL/D.250/LS.100-D63H70P25]
C129  220uF/16V  [CYL/D.250/LS.100-D63H70P25]
C132  0.1uF  [C 0805]
C134  0.1uF  [C 0805]
C135  0.1uF  [C 0805]
C136  0.1uF  [C 0805]
D101  SS34  [DO-214AB (SMC)]
D102  LED RED 3MM  [LED 3MM - red]  (value not drawn)
D103  SS34  [DO-214AC (SMA) L]
D104  LED RED 3MM  [LED 3MM - red]  (value not drawn)
D105  LED RED 3MM  [LED 3MM - red]  (value not drawn)
D106  SS34  [DO-214AC (SMA) L]
D107  LED RED 3MM  [LED 3MM - red]  (value not drawn)
D108  NA/MB6S  [DiodeBridge-SOIC4]
GND2  Test Point  [TESTPOINT/1/Black]  (value not drawn)  (no BOM)
GND3  Test Point  [TESTPOINT/1/Black]  (value not drawn)  (no BOM)
H101  Screw Hole  [SCREW/3.0/6.0]  (value not drawn)  (no BOM)
H102  Screw Hole  [SCREW/3.0/6.0]  (value not drawn)  (no BOM)
L101  33uH  [Inductor SMD 6.5x6.5x3.0]  (no BOM)
L102  FB  [L 0805 (2012)]
L103  FB  [L 0805 (2012)]
L104  33uH  [Inductor SMD 12x12x8]
L105  33uH  [Inductor SMD 12x12x8]  (value not drawn)
L106  FB  [L 0805 (2012)]
L107  FB  [L 0805 (2012)]
P101  Header 2  [HDR/Terminal/2/KF55C-10]
P102  Header 3  [HDR/Header/3/VH]
P103  Header 2  [HDR/Header/2/VH]
P104  AC-DC 12V2A  [AC-DC 12V2A]
P105  Header 2  [HDR/Terminal/2/KF1000]  (no BOM)
P106  Header 2  [HDR/Terminal/2/KF1000]  (value not drawn)  (no BOM)
R101  4.7K  [R 0603]
R102  330R  [R 0603]
R103  10K  [R 0805]
R104  1K  [R 0603]
R105  10K  [R 0805]
R106  330R  [R 0603]
R107  NA/10K  [R 0805]
T101  NA/TRANS-EE10  [Trans. EE10/6P/F]
U101  LM1117MPX-1.8/NOPB  [SOT-223]
U102  LM1117MPX-3.3/NOPB  [SOT-223]
U103  LM1117MPX-3.3/NOPB  [SOT-223]
U104  LM2596SX-5.0  [TO-263-6]
VCC  Test Point  [TestPoint/SMD/1.5mm]  (no BOM)
VR101  Varistor  [VARISTOR DISC 5MM/7MM]

### Ports
AC_REF (out)

### Nets
1V8: 1V8.1(TP) C111.1 C112.1 L102.2
3V3_EXT: 3V3EXT.1(TP) C113.1 C118.1 D107.1(A) L107.2
5V: 5V.1(TP) C108.1 C109.1 C114.1 C115.1 C120.1 C121.1 C126.1 C132.1 D104.1(A) L104.2 U101.3(VIN) U102.3(VIN) U103.3(VIN) U104.4(FB)
12V: 12V.1(TP) C102.1 C103.1 C134.1 C135.1 C136.1 D101.2(K) D102.1(A) D103.1(A)
ACL: C101.1 H101.1(Screw) P101.1 P102.1 P104.1(AC_IN_L) P105.1 P106.2 T101.2(A2) VR101.2
ACN: C101.2 H102.1(Screw) P101.2 P102.3 P104.2(AC_IN_N) P105.2 P106.1 T101.1(A1) VR101.1
GND: C102.2 C103.2 C104.2 C105.2 C106.1 C108.2 C109.2 C110.2 C113.2 C114.2 C115.2 C116.2 C117.2 C118.2 C119.2 C120.2 C121.2 C122.2 C123.2 C124.2 C125.2 C126.2 C128.2 C129.2 C132.2 C134.2 C135.2 C136.2 D106.1(A) D108.4(-) GND2.1(TP) GND3.1(TP) L106.1 P103.2 P104.4(DC_OUT-) R101.1 R102.1 R104.1 R105.1 R106.1 U101.1(GND) U102.1(GND) U103.1(GND) U104.3(GND) U104.5(~{ON}/OFF) U104.6(PAD)
GND18: C111.2 C112.2 L106.2
GNDEARTH: C106.2 C107.2
VCC: C119.1 C129.1 D105.1(A) L103.2 VCC.1(TP)
NetC104_1: C104.1 C105.1 D101.1(A) L101.1 L105.1
NetC107_1: C107.1 L101.2 L105.2 P103.1 P104.3(DC_OUT+)
NetC110_1: C110.1 C123.1 L102.1 U101.2(VOUT) U101.4(VO)
NetC116_1: C116.1 C117.1 L107.1 U102.2(VOUT) U102.4(VO)
NetC122_1: C122.1 C128.1 L103.1 U103.2(VOUT) U103.4(VO)
NetC124_1: C124.1 C125.1 D103.2(K) U104.1(Vin)
NetD102_2: D102.2(K) R101.2
NetD104_2: D104.2(K) R104.2
NetD105_2: D105.2(K) R106.2
NetD106_2: D106.2(K) L104.1 U104.2(Out)
NetD107_2: D107.2(K) R102.2
NetD108_1: D108.1 T101.3(B1)
NetD108_2: D108.2 T101.4(B2)
NetD108_3: D108.3(+) R103.2
NetR103_1: R103.1 R105.2 ; port AC_REF
NetR107_1: R107.1 T101.5(C2)
NetR107_2: R107.2 T101.6(C1)

Not connected (* = marked no-connect by the designer): P102 2

### Notes on the sheet
- AC-DC MODULE
- 1.8V FOR TA12
- 5V SYSTEM POWER
- 3.3V SYSTEM POWER
- Title
- Size:
- Date:
- A4
- Number:
- Time:
- Revision:
- Sheet
- of
- NPN
- Lab
- File:
- (in symbol Trans 6-PIN) Pri; Sec; Aux

### Library data of the parts
C101 = Capacitor NP: Capacitor non-pol; TYPE: NA
C102 C105 C109 C111 C113 C115 C116 C119 C121-C123 C125 C132 C134-C136 = Capacitor NP: CAP CER 0.1UF 50V X7R 0805; TYPE: SMD; PACKAGE: SMD0805; STOCK CODE: CL21B104KBNC; SUPPLIER: tme.vn; STOCK DESC: 100nF/50V ±10% X7R SMD-0805 Capacitor; UNIT PRICE: 400
C103 C104 C124 C126 = Capacitor: CAP ALUM 1000UF 20% 25V RADIAL; BRAND: JWCO; TYPE: TH; PACKAGE: 10x17mm; STOCK CODE: 1000uF/25V; SUPPLIER: tme.vn; STOCK DESC: 1000uF/25V ±20% Aluminum Electrolytic Capacitor, Size 10x17mm; UNIT PRICE: 3000
C106 C107 = Capacitor NP: Capacitor non-pol; TYPE: NA
C108 C114 C120 = Capacitor NP: CAP CER 22UF 10% 16V X7R 1210; TYPE: SMD; PACKAGE: SMD1210; STOCK CODE: CC1210KKX7R7BB226; SUPPLIER: tme.vn; STOCK DESC: 22uF/16V ±10% X7R SMD-1210 Capacitor; UNIT PRICE: 2500
C110 C112 C117 C118 C128 C129 = Capacitor: CAP ALUM 220UF 20% 16V RADIAL; TYPE: TH; PACKAGE: 6.3x12; STOCK CODE: 220uF/16V; SUPPLIER: tme.vn; STOCK DESC: 220uF/16V ±20% Aluminum Electrolytic Capacitor, Size 6.3x12mm; UNIT PRICE: 900
D101 = Diode Schottky: DIODE SCHOTTKY 40V 3A SUB SMA; BRAND: Toshiba; TYPE: SMD; PACKAGE: DO-214AC; PART NO: SS34; STOCK CODE: SS34; SUPPLIER: tme.vn; STOCK DESC: 3A 40V Schottky Barrier Diode; UNIT PRICE: 2000
D102 D104 D105 D107 = Led: LED RED DIFFUSED 3MM ROUND T/H; TYPE: TH; PACKAGE: 3MM; STOCK CODE: HT204SURD; SUPPLIER: tme.vn; STOCK DESC: 3mm Base LED; UNIT PRICE: 300
D103 D106 = Diode: DIODE SCHOTTKY 40V 3A SUB SMA; BRAND: Toshiba; TYPE: SMD; PACKAGE: DO-214AC; PART NO: SS34; STOCK CODE: SS34; SUPPLIER: tme.vn; STOCK DESC: 3A 40V Schottky Barrier Diode; UNIT PRICE: 2000
D108 = DIODE BRIDGE: BRIDGE RECT 1P 600V 500MA 4SOIC; pin to pad: 1>3 2>4 3>1 4>2; PART NO: MB6S; TYPE: NA; PACKAGE: MBS (TO-269AA); STOCK CODE: MB6S
L101 = Inductor: FIXED IND 33UH 3A 105 MOHM SMD; TYPE: NO-BOM; UNIT PRICE: 0
L102 L103 L106 L107 = Inductor: Chip Ferrite Bead; TYPE: SMD; PACKAGE: SMD0805; STOCK CODE: CB2012D300ST(F); SUPPLIER: tme.vn; STOCK DESC: 30 Ohm SMD-0805 Chip Ferrite Bead; UNIT PRICE: 500
L104 L105 = Inductor: FIXED IND 33UH 3A 64.8 MOHM SMD; PACKAGE: SMD121208; SUPPLIER: tme.vn; TYPE: SMD; UNIT PRICE: 9000
P101 P103 P105 P106 = Header 2: Header, 2-Pin
  P101: TYPE: NA
  P103: TYPE: NA; UNIT PRICE: 0
  P105 P106: TYPE: NO-BOM
P102 = Header 3: Header, 3-Pin; TYPE: NA; UNIT PRICE: 0
P104 = AC-DC 12V3A: AC-DC 12V2A MODULE; SUPPLIER: CHINA; TYPE: TH; UNIT PRICE: 558676
R101 = Resistor: RES SMD 4.7K OHM 1% 1/10W 0603; PACKAGE: SMD0603; STOCK CODE: RM06JTN472; SUPPLIER: tme.vn; TYPE: SMD; STOCK DESC: 4.7K ±5% SMD-0603 Resistor; UNIT PRICE: 50
R102 R106 = Resistor: RES SMD 330 OHM 1% 1/10W 0603; PACKAGE: SMD0603; STOCK CODE: RM06JTN331; SUPPLIER: tme.vn; TYPE: SMD; STOCK DESC: 330R ±5% SMD-0603 Resistor; UNIT PRICE: 50
R103 R105 = Resistor: RES SMD 10K OHM 1% 1/8W 0805; PACKAGE: SMD0805; STOCK CODE: RM10JTN103; SUPPLIER: tme.vn; TYPE: SMD; STOCK DESC: 10K ±5% SMD-0805 Resistor; UNIT PRICE: 50
R104 = Resistor: RES SMD 1K OHM 1% 1/10W 0603; PACKAGE: SMD0603; STOCK CODE: RM06JTN102; SUPPLIER: tme.vn; TYPE: SMD; STOCK DESC: 1K ±5% SMD-0603 Resistor; UNIT PRICE: 50
R107 = Resistor: RES SMD 10K OHM 5% 1/8W 0805; PACKAGE: SMD0805; STOCK CODE: RM06JTN472; SUPPLIER: tme.vn; TYPE: SMD; STOCK DESC: 4.7K ±5% SMD-0603 Resistor; UNIT PRICE: 50
T101 = Trans 6-PIN: Transformer 6-PIN; TYPE: NA; UNIT PRICE: 5500
U101 = AMS1117: IC REG LINEAR 1.8V 800MA SOT223; BRAND: AMS; PACKAGE: SOT-223; STOCK CODE: AMS1117-1.8; SUPPLIER: tme.vn; TYPE: SMD; STOCK DESC: 1.8V 1A Low-dropout Linear Regulator; UNIT PRICE: 4000
U102 U103 = AMS1117: IC REG LINEAR 3.3V 800MA SOT223; BRAND: AMS; PACKAGE: SOT-223; STOCK CODE: AMS1117-3.3; SUPPLIER: tme.vn; TYPE: SMD; STOCK DESC: 3.3V 1A Low-dropout Linear Regulator; UNIT PRICE: 4000
U104 = LM2576SX-5.0: IC REG BUCK 5V 3A TO263-5; PART NO: LM2576SX-5.0/NOPB; BRAND: TI; PACKAGE: TO-263-6; STOCK CODE: LM2576SX-5.0/NOPBCT-ND; SUPPLIER: Digi-Key; TYPE: SMD; STOCK DESC: IC REG BUCK 5V 3A TO263-5; UNIT PRICE: 64445
1V8 3V3EXT 5V 12V GND2 GND3 VCC = Test Point: TYPE: NO-BOM; UNIT PRICE: 0
H101 H102 = Screw Hole: TYPE: NO-BOM; UNIT PRICE: 0
VR101 = Varistor: TYPE: NA; UNIT PRICE: 0

## Sheet eBox_ACdetect.SchDoc: eBox_AC_Detect (1)
size A4; DocumentNumber: 6; SheetNumber: 6; SheetTotal: 9
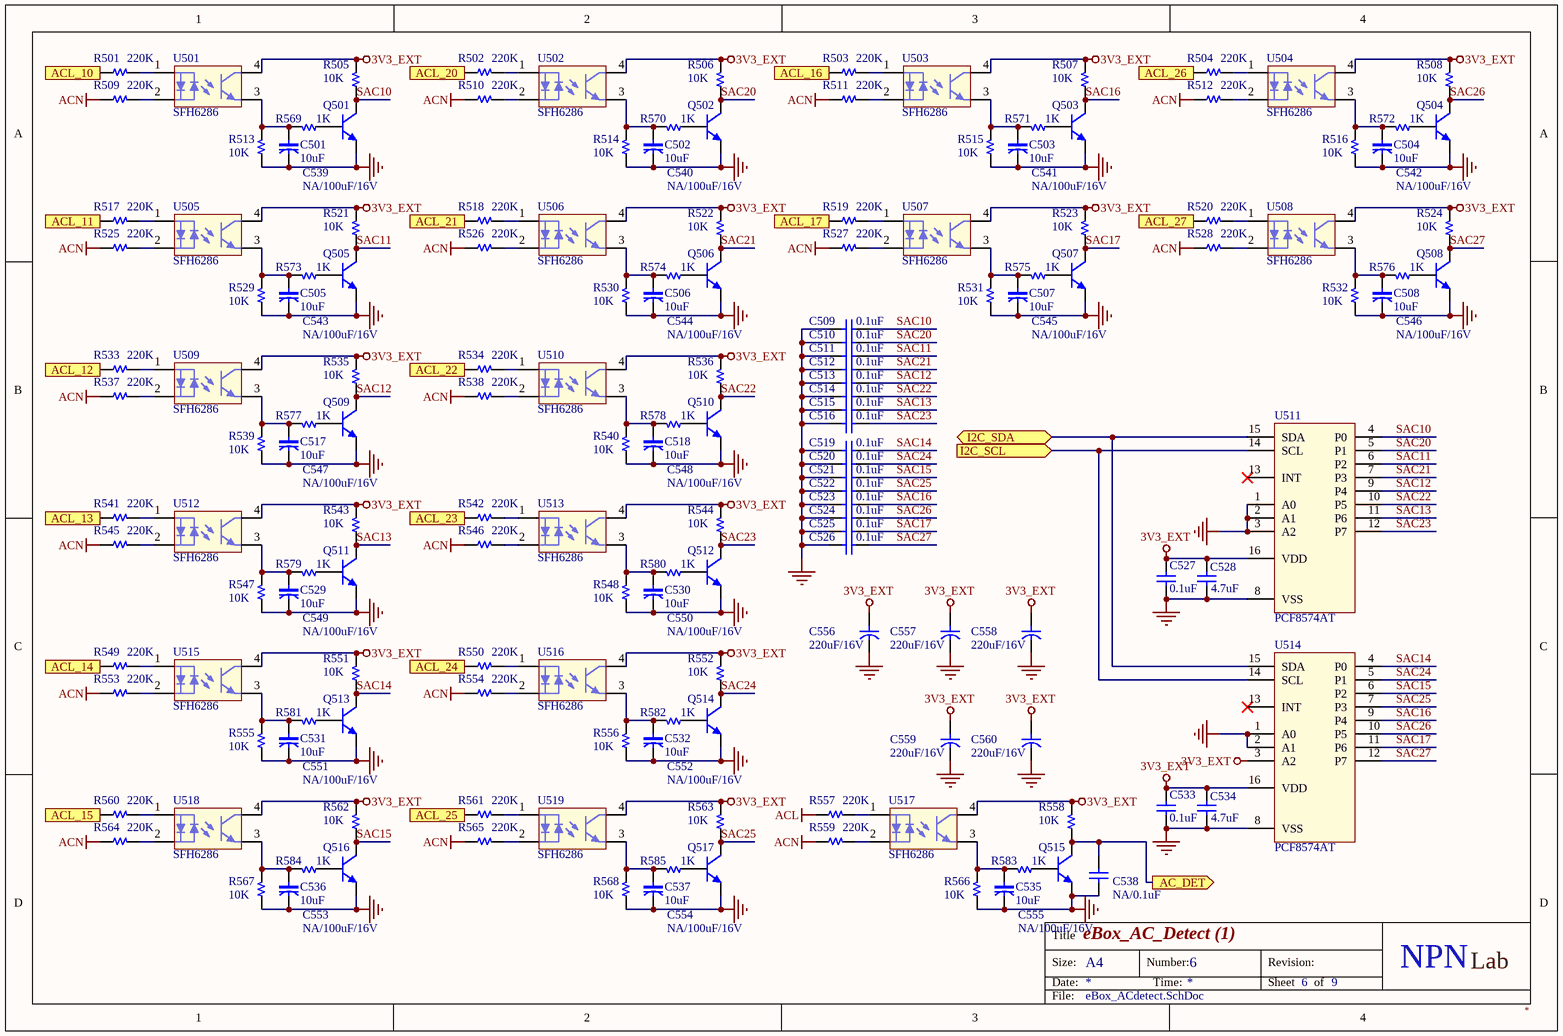
[diagram p5: eBox_ACdetect.SchDoc]

### Parts
C501  10uF  [C 0805]
C502  10uF  [C 0805]
C503  10uF  [C 0805]
C504  10uF  [C 0805]
C505  10uF  [C 0805]
C506  10uF  [C 0805]
C507  10uF  [C 0805]
C508  10uF  [C 0805]
C509  0.1uF  [C 0805]
C510  0.1uF  [C 0805]
C511  0.1uF  [C 0805]
C512  0.1uF  [C 0805]
C513  0.1uF  [C 0805]
C514  0.1uF  [C 0805]
C515  0.1uF  [C 0805]
C516  0.1uF  [C 0805]
C517  10uF  [C 0805]
C518  10uF  [C 0805]
C519  0.1uF  [C 0805]
C520  0.1uF  [C 0805]
C521  0.1uF  [C 0805]
C522  0.1uF  [C 0805]
C523  0.1uF  [C 0805]
C524  0.1uF  [C 0805]
C525  0.1uF  [C 0805]
C526  0.1uF  [C 0805]
C527  0.1uF  [C 0603]
C528  4.7uF  [C 0603]
C529  10uF  [C 0805]
C530  10uF  [C 0805]
C531  10uF  [C 0805]
C532  10uF  [C 0805]
C533  0.1uF  [C 0603]
C534  4.7uF  [C 0603]
C535  10uF  [C 0805]
C536  10uF  [C 0805]
C537  10uF  [C 0805]
C538  NA/0.1uF  [C 0805]
C539  NA/100uF/16V  [CYL/D.200/LS.75-D50H70P20]
C540  NA/100uF/16V  [CYL/D.200/LS.75-D50H70P20]
C541  NA/100uF/16V  [CYL/D.200/LS.75-D50H70P20]
C542  NA/100uF/16V  [CYL/D.200/LS.75-D50H70P20]
C543  NA/100uF/16V  [CYL/D.200/LS.75-D50H70P20]
C544  NA/100uF/16V  [CYL/D.200/LS.75-D50H70P20]
C545  NA/100uF/16V  [CYL/D.200/LS.75-D50H70P20]
C546  NA/100uF/16V  [CYL/D.200/LS.75-D50H70P20]
C547  NA/100uF/16V  [CYL/D.200/LS.75-D50H70P20]
C548  NA/100uF/16V  [CYL/D.200/LS.75-D50H70P20]
C549  NA/100uF/16V  [CYL/D.200/LS.75-D50H70P20]
C550  NA/100uF/16V  [CYL/D.200/LS.75-D50H70P20]
C551  NA/100uF/16V  [CYL/D.200/LS.75-D50H70P20]
C552  NA/100uF/16V  [CYL/D.200/LS.75-D50H70P20]
C553  NA/100uF/16V  [CYL/D.200/LS.75-D50H70P20]
C554  NA/100uF/16V  [CYL/D.200/LS.75-D50H70P20]
C555  NA/100uF/16V  [CYL/D.200/LS.75-D50H70P20]
C556  220uF/16V  [CYL/D.250/LS.100-D63H70P25]
C557  220uF/16V  [CYL/D.250/LS.100-D63H70P25]
C558  220uF/16V  [CYL/D.250/LS.100-D63H70P25]
C559  220uF/16V  [CYL/D.250/LS.100-D63H70P25]
C560  220uF/16V  [CYL/D.250/LS.100-D63H70P25]
Q501  MMBT3904LT1G  [SOT-23]  (value not drawn)
Q502  MMBT3904LT1G  [SOT-23]  (value not drawn)
Q503  MMBT3904LT1G  [SOT-23]  (value not drawn)
Q504  MMBT3904LT1G  [SOT-23]  (value not drawn)
Q505  MMBT3904LT1G  [SOT-23]  (value not drawn)
Q506  MMBT3904LT1G  [SOT-23]  (value not drawn)
Q507  MMBT3904LT1G  [SOT-23]  (value not drawn)
Q508  MMBT3904LT1G  [SOT-23]  (value not drawn)
Q509  MMBT3904LT1G  [SOT-23]  (value not drawn)
Q510  MMBT3904LT1G  [SOT-23]  (value not drawn)
Q511  MMBT3904LT1G  [SOT-23]  (value not drawn)
Q512  MMBT3904LT1G  [SOT-23]  (value not drawn)
Q513  MMBT3904LT1G  [SOT-23]  (value not drawn)
Q514  MMBT3904LT1G  [SOT-23]  (value not drawn)
Q515  MMBT3904LT1G  [SOT-23]  (value not drawn)
Q516  MMBT3904LT1G  [SOT-23]  (value not drawn)
Q517  MMBT3904LT1G  [SOT-23]  (value not drawn)
R501  220K  [R 0805]
R502  220K  [R 0805]
R503  220K  [R 0805]
R504  220K  [R 0805]
R505  10K  [R 0805]
R506  10K  [R 0805]
R507  10K  [R 0805]
R508  10K  [R 0805]
R509  220K  [R 0805]
R510  220K  [R 0805]
R511  220K  [R 0805]
R512  220K  [R 0805]
R513  10K  [R 0805]
R514  10K  [R 0805]
R515  10K  [R 0805]
R516  10K  [R 0805]
R517  220K  [R 0805]
R518  220K  [R 0805]
R519  220K  [R 0805]
R520  220K  [R 0805]
R521  10K  [R 0805]
R522  10K  [R 0805]
R523  10K  [R 0805]
R524  10K  [R 0805]
R525  220K  [R 0805]
R526  220K  [R 0805]
R527  220K  [R 0805]
R528  220K  [R 0805]
R529  10K  [R 0805]
R530  10K  [R 0805]
R531  10K  [R 0805]
R532  10K  [R 0805]
R533  220K  [R 0805]
R534  220K  [R 0805]
R535  10K  [R 0805]
R536  10K  [R 0805]
R537  220K  [R 0805]
R538  220K  [R 0805]
R539  10K  [R 0805]
R540  10K  [R 0805]
R541  220K  [R 0805]
R542  220K  [R 0805]
R543  10K  [R 0805]
R544  10K  [R 0805]
R545  220K  [R 0805]
R546  220K  [R 0805]
R547  10K  [R 0805]
R548  10K  [R 0805]
R549  220K  [R 0805]
R550  220K  [R 0805]
R551  10K  [R 0805]
R552  10K  [R 0805]
R553  220K  [R 0805]
R554  220K  [R 0805]
R555  10K  [R 0805]
R556  10K  [R 0805]
R557  220K  [R 0805]
R558  10K  [R 0805]
R559  220K  [R 0805]
R560  220K  [R 0805]
R561  220K  [R 0805]
R562  10K  [R 0805]
R563  10K  [R 0805]
R564  220K  [R 0805]
R565  220K  [R 0805]
R566  10K  [R 0805]
R567  10K  [R 0805]
R568  10K  [R 0805]
R569  1K  [R 0805]
R570  1K  [R 0805]
R571  1K  [R 0805]
R572  1K  [R 0805]
R573  1K  [R 0805]
R574  1K  [R 0805]
R575  1K  [R 0805]
R576  1K  [R 0805]
R577  1K  [R 0805]
R578  1K  [R 0805]
R579  1K  [R 0805]
R580  1K  [R 0805]
R581  1K  [R 0805]
R582  1K  [R 0805]
R583  1K  [R 0805]
R584  1K  [R 0805]
R585  1K  [R 0805]
U501  SFH6286  [SOP4 - SFH6286]
U502  SFH6286  [SOP4 - SFH6286]
U503  SFH6286  [SOP4 - SFH6286]
U504  SFH6286  [SOP4 - SFH6286]
U505  SFH6286  [SOP4 - SFH6286]
U506  SFH6286  [SOP4 - SFH6286]
U507  SFH6286  [SOP4 - SFH6286]
U508  SFH6286  [SOP4 - SFH6286]
U509  SFH6286  [SOP4 - SFH6286]
U510  SFH6286  [SOP4 - SFH6286]
U511  PCF8574AT  [SO16/PCF8574AT]
U512  SFH6286  [SOP4 - SFH6286]
U513  SFH6286  [SOP4 - SFH6286]
U514  PCF8574AT  [SO16/PCF8574AT]
U515  SFH6286  [SOP4 - SFH6286]
U516  SFH6286  [SOP4 - SFH6286]
U517  SFH6286  [SOP4 - SFH6286]
U518  SFH6286  [SOP4 - SFH6286]
U519  SFH6286  [SOP4 - SFH6286]

### Ports
AC_DET (out), ACL_10 (in), ACL_11 (in), ACL_12 (in), ACL_13 (in), ACL_14 (in), ACL_15 (in), ACL_16 (in), ACL_17 (in), ACL_20 (in), ACL_21 (in), ACL_22 (in), ACL_23 (in), ACL_24 (in), ACL_25 (in), ACL_26 (in), ACL_27 (in), I2C_SCL (in), I2C_SDA (bidir)

### Nets
3V3_EXT: C527.1 C528.1 C533.1 C534.1 C556.1 C557.1 C558.1 C559.1 C560.1 R505.2 R506.2 R507.2 R508.2 R521.2 R522.2 R523.2 R524.2 R535.2 R536.2 R543.2 R544.2 R551.2 R552.2 R558.2 R562.2 R563.2 U501.4(C) U502.4(C) U503.4(C) U504.4(C) U505.4(C) U506.4(C) U507.4(C) U508.4(C) U509.4(C) U510.4(C) U511.16(VDD) U512.4(C) U513.4(C) U514.3(A2) U514.16(VDD) U515.4(C) U516.4(C) U517.4(C) U518.4(C) U519.4(C)
ACL: R557.1
ACN: R509.1 R510.1 R511.1 R512.1 R525.1 R526.1 R527.1 R528.1 R537.1 R538.1 R545.1 R546.1 R553.1 R554.1 R559.1 R564.1 R565.1
GND: C501.2 C502.2 C503.2 C504.2 C505.2 C506.2 C507.2 C508.2 C509.1 C510.1 C511.1 C512.1 C513.1 C514.1 C515.1 C516.1 C517.2 C518.2 C519.1 C520.1 C521.1 C522.1 C523.1 C524.1 C525.1 C526.1 C527.2 C528.2 C529.2 C530.2 C531.2 C532.2 C533.2 C534.2 C535.2 C536.2 C537.2 C538.1 C539.2 C540.2 C541.2 C542.2 C543.2 C544.2 C545.2 C546.2 C547.2 C548.2 C549.2 C550.2 C551.2 C552.2 C553.2 C554.2 C555.2 C556.2 C557.2 C558.2 C559.2 C560.2 Q501.2(E) Q502.2(E) Q503.2(E) Q504.2(E) Q505.2(E) Q506.2(E) Q507.2(E) Q508.2(E) Q509.2(E) Q510.2(E) Q511.2(E) Q512.2(E) Q513.2(E) Q514.2(E) Q515.2(E) Q516.2(E) Q517.2(E) R513.1 R514.1 R515.1 R516.1 R529.1 R530.1 R531.1 R532.1 R539.1 R540.1 R547.1 R548.1 R555.1 R556.1 R566.1 R567.1 R568.1 U511.1(A0) U511.2(A1) U511.3(A2) U511.8(VSS) U514.1(A0) U514.2(A1) U514.8(VSS)
ACL10: R501.1 ; port ACL_10
ACL11: R517.1 ; port ACL_11
ACL12: R533.1 ; port ACL_12
ACL13: R541.1 ; port ACL_13
ACL14: R549.1 ; port ACL_14
ACL15: R560.1 ; port ACL_15
ACL16: R503.1 ; port ACL_16
ACL17: R519.1 ; port ACL_17
ACL20: R502.1 ; port ACL_20
ACL21: R518.1 ; port ACL_21
ACL22: R534.1 ; port ACL_22
ACL23: R542.1 ; port ACL_23
ACL24: R550.1 ; port ACL_24
ACL25: R561.1 ; port ACL_25
ACL26: R504.1 ; port ACL_26
ACL27: R520.1 ; port ACL_27
I2C1_SCL: U511.14(SCL) U514.14(SCL) ; port I2C_SCL
I2C1_SDA: U511.15(SDA) U514.15(SDA) ; port I2C_SDA
SAC10: C509.2 Q501.3(C) R505.1 U511.4(P0)
SAC11: C511.2 Q505.3(C) R521.1 U511.6(P2)
SAC12: C513.2 Q509.3(C) R535.1 U511.9(P4)
SAC13: C515.2 Q511.3(C) R543.1 U511.11(P6)
SAC14: C519.2 Q513.3(C) R551.1 U514.4(P0)
SAC15: C521.2 Q516.3(C) R562.1 U514.6(P2)
SAC16: C523.2 Q503.3(C) R507.1 U514.9(P4)
SAC17: C525.2 Q507.3(C) R523.1 U514.11(P6)
SAC20: C510.2 Q502.3(C) R506.1 U511.5(P1)
SAC21: C512.2 Q506.3(C) R522.1 U511.7(P3)
SAC22: C514.2 Q510.3(C) R536.1 U511.10(P5)
SAC23: C516.2 Q512.3(C) R544.1 U511.12(P7)
SAC24: C520.2 Q514.3(C) R552.1 U514.5(P1)
SAC25: C522.2 Q517.3(C) R563.1 U514.7(P3)
SAC26: C524.2 Q504.3(C) R508.1 U514.10(P5)
SAC27: C526.2 Q508.3(C) R524.1 U514.12(P7)
NetC501_1: C501.1 C539.1 R513.2 R569.2 U501.3(E)
NetC502_1: C502.1 C540.1 R514.2 R570.2 U502.3(E)
NetC503_1: C503.1 C541.1 R515.2 R571.2 U503.3(E)
NetC504_1: C504.1 C542.1 R516.2 R572.2 U504.3(E)
NetC505_1: C505.1 C543.1 R529.2 R573.2 U505.3(E)
NetC506_1: C506.1 C544.1 R530.2 R574.2 U506.3(E)
NetC507_1: C507.1 C545.1 R531.2 R575.2 U507.3(E)
NetC508_1: C508.1 C546.1 R532.2 R576.2 U508.3(E)
NetC517_1: C517.1 C547.1 R539.2 R577.2 U509.3(E)
NetC518_1: C518.1 C548.1 R540.2 R578.2 U510.3(E)
NetC529_1: C529.1 C549.1 R547.2 R579.2 U512.3(E)
NetC530_1: C530.1 C550.1 R548.2 R580.2 U513.3(E)
NetC531_1: C531.1 C551.1 R555.2 R581.2 U515.3(E)
NetC532_1: C532.1 C552.1 R556.2 R582.2 U516.3(E)
NetC535_1: C535.1 C555.1 R566.2 R583.2 U517.3(E)
NetC536_1: C536.1 C553.1 R567.2 R584.2 U518.3(E)
NetC537_1: C537.1 C554.1 R568.2 R585.2 U519.3(E)
NetC538_2: C538.2 Q515.3(C) R558.1 ; port AC_DET
NetQ501_1: Q501.1(B) R569.1
NetQ502_1: Q502.1(B) R570.1
NetQ503_1: Q503.1(B) R571.1
NetQ504_1: Q504.1(B) R572.1
NetQ505_1: Q505.1(B) R573.1
NetQ506_1: Q506.1(B) R574.1
NetQ507_1: Q507.1(B) R575.1
NetQ508_1: Q508.1(B) R576.1
NetQ509_1: Q509.1(B) R577.1
NetQ510_1: Q510.1(B) R578.1
NetQ511_1: Q511.1(B) R579.1
NetQ512_1: Q512.1(B) R580.1
NetQ513_1: Q513.1(B) R581.1
NetQ514_1: Q514.1(B) R582.1
NetQ515_1: Q515.1(B) R583.1
NetQ516_1: Q516.1(B) R584.1
NetQ517_1: Q517.1(B) R585.1
NetR501_2: R501.2 U501.1(A/C)
NetR502_2: R502.2 U502.1(A/C)
NetR503_2: R503.2 U503.1(A/C)
NetR504_2: R504.2 U504.1(A/C)
NetR509_2: R509.2 U501.2(C/A)
NetR510_2: R510.2 U502.2(C/A)
NetR511_2: R511.2 U503.2(C/A)
NetR512_2: R512.2 U504.2(C/A)
NetR517_2: R517.2 U505.1(A/C)
NetR518_2: R518.2 U506.1(A/C)
NetR519_2: R519.2 U507.1(A/C)
NetR520_2: R520.2 U508.1(A/C)
NetR525_2: R525.2 U505.2(C/A)
NetR526_2: R526.2 U506.2(C/A)
NetR527_2: R527.2 U507.2(C/A)
NetR528_2: R528.2 U508.2(C/A)
NetR533_2: R533.2 U509.1(A/C)
NetR534_2: R534.2 U510.1(A/C)
NetR537_2: R537.2 U509.2(C/A)
NetR538_2: R538.2 U510.2(C/A)
NetR541_2: R541.2 U512.1(A/C)
NetR542_2: R542.2 U513.1(A/C)
NetR545_2: R545.2 U512.2(C/A)
NetR546_2: R546.2 U513.2(C/A)
NetR549_2: R549.2 U515.1(A/C)
NetR550_2: R550.2 U516.1(A/C)
NetR553_2: R553.2 U515.2(C/A)
NetR554_2: R554.2 U516.2(C/A)
NetR557_2: R557.2 U517.1(A/C)
NetR559_2: R559.2 U517.2(C/A)
NetR560_2: R560.2 U518.1(A/C)
NetR561_2: R561.2 U519.1(A/C)
NetR564_2: R564.2 U518.2(C/A)
NetR565_2: R565.2 U519.2(C/A)

Not connected (* = marked no-connect by the designer): U511 13(INT)*; U514 13(INT)*

### Notes on the sheet
- Title
- Size:
- Date:
- A4
- Number:
- Time:
- Revision:
- Sheet
- of
- NPN
- Lab
- File:

### Library data of the parts
C501-C526 C529-C532 C535-C537 = Capacitor NP: CAP CER 0.1UF 50V X7R 0805; TYPE: SMD; PACKAGE: SMD0805; STOCK CODE: CL21B104KBNC; SUPPLIER: tme.vn; STOCK DESC: 100nF/50V ±10% X7R SMD-0805 Capacitor
  C501-C508 C517 C518 C529-C532 C535-C537: UNIT PRICE: 500
  C509-C516 C519-C526: UNIT PRICE: 400
C527 C533 = Capacitor NP: CAP CER 0.1UF 50V X7R 0603; TYPE: SMD; PACKAGE: SMD0603; STOCK CODE: CC0603KRX7R9BB104; SUPPLIER: tme.vn; STOCK DESC: 100nF/50V ±10% X7R SMD-0603 Capacitor; UNIT PRICE: 400
C528 C534 = Capacitor NP: CAP CER 4.7UF 50V X7R 0603; TYPE: SMD; PACKAGE: SMD0603; STOCK CODE: CC0603KRX5R6BB475; SUPPLIER: tme.vn; STOCK DESC: 4.7uF 10V ±10% X5R SMD-0603 Capacitor; UNIT PRICE: 600
C538 = Capacitor NP: CAP CER 0.1UF 50V X7R 0805; TYPE: NA; PACKAGE: SMD0805; STOCK CODE: CL21B104KBNC; SUPPLIER: tme.vn; STOCK DESC: 100nF/50V ±10% X7R SMD-0805 Capacitor; UNIT PRICE: 400
C539-C555 = Capacitor: CAP ALUM 100UF 20% 16V RADIAL; TYPE: NA; PACKAGE: 5x7 mm; STOCK CODE: 100uF/16V; SUPPLIER: tme.vn; STOCK DESC: 100uF/16V ±20% Aluminum Electrolytic Capacitor, 5x7 mm; UNIT PRICE: 800
C556-C560 = Capacitor: CAP ALUM 220UF 20% 16V RADIAL; TYPE: TH; PACKAGE: 6.3x12; STOCK CODE: 220uF/16V; SUPPLIER: tme.vn; STOCK DESC: 220uF/16V ±20% Aluminum Electrolytic Capacitor, Size 6.3x12mm; UNIT PRICE: 900
Q501-Q517 = Transistor NPN: TRANS NPN 40V 0.2A SOT23; TYPE: SMD; STOCK CODE: LMBT3904LT1G; SUPPLIER: tme.vn; STOCK DESC: NPN General-Purpose Amplifier SMD Transistor; UNIT PRICE: 600
R501-R504 R509-R512 R517-R520 R525-R528 R533 R534 R537 R538 R541 R542 R545 R546 R549 R550 R553 R554 R557 R559-R561 R564 R565 = Resistor: RES SMD 220K OHM 1% 1/8W 0805; PACKAGE: SMD0805; STOCK CODE: RM10JTN224; SUPPLIER: tme.vn; TYPE: SMD; STOCK DESC: 220K 5% SMD-0805 Resistor; UNIT PRICE: 60
R505-R508 R513-R516 R521-R524 R529-R532 R535 R536 R539 R540 R543 R544 R547 R548 R551 R552 R555 R556 R558 R562 R563 R566-R568 = Resistor: RES SMD 10K OHM 1% 1/8W 0805; PACKAGE: SMD0805; STOCK CODE: RM10JTN103; SUPPLIER: tme.vn; TYPE: SMD; STOCK DESC: 10K ±5% SMD-0805 Resistor; UNIT PRICE: 60
R569-R585 = Resistor: RES SMD 1K OHM 5% 1/8W 0805; PACKAGE: SMD0805; STOCK CODE: RM10JTN102; SUPPLIER: tme.vn; TYPE: SMD; STOCK DESC: 1K 5% SMD-0805 Resistor; UNIT PRICE: 60
U511 U514 = PCF8574AT: Remote 8-bit I/O expander for I2C-bus with interrupt; PART NO: PCF8574AT/3; BRAND: NXP; PACKAGE: SO16; SUPPLIER: CHINA; TYPE: SMD; UNIT PRICE: 6160
U501-U510 U512 U513 U515-U519 = SFH6286: SUPPLIER: CHINA; TYPE: SMD; UNIT PRICE: 3600